# EAGLE schematic module_alu (EAGLE 6.5.0)

## Sheet 1 of 12
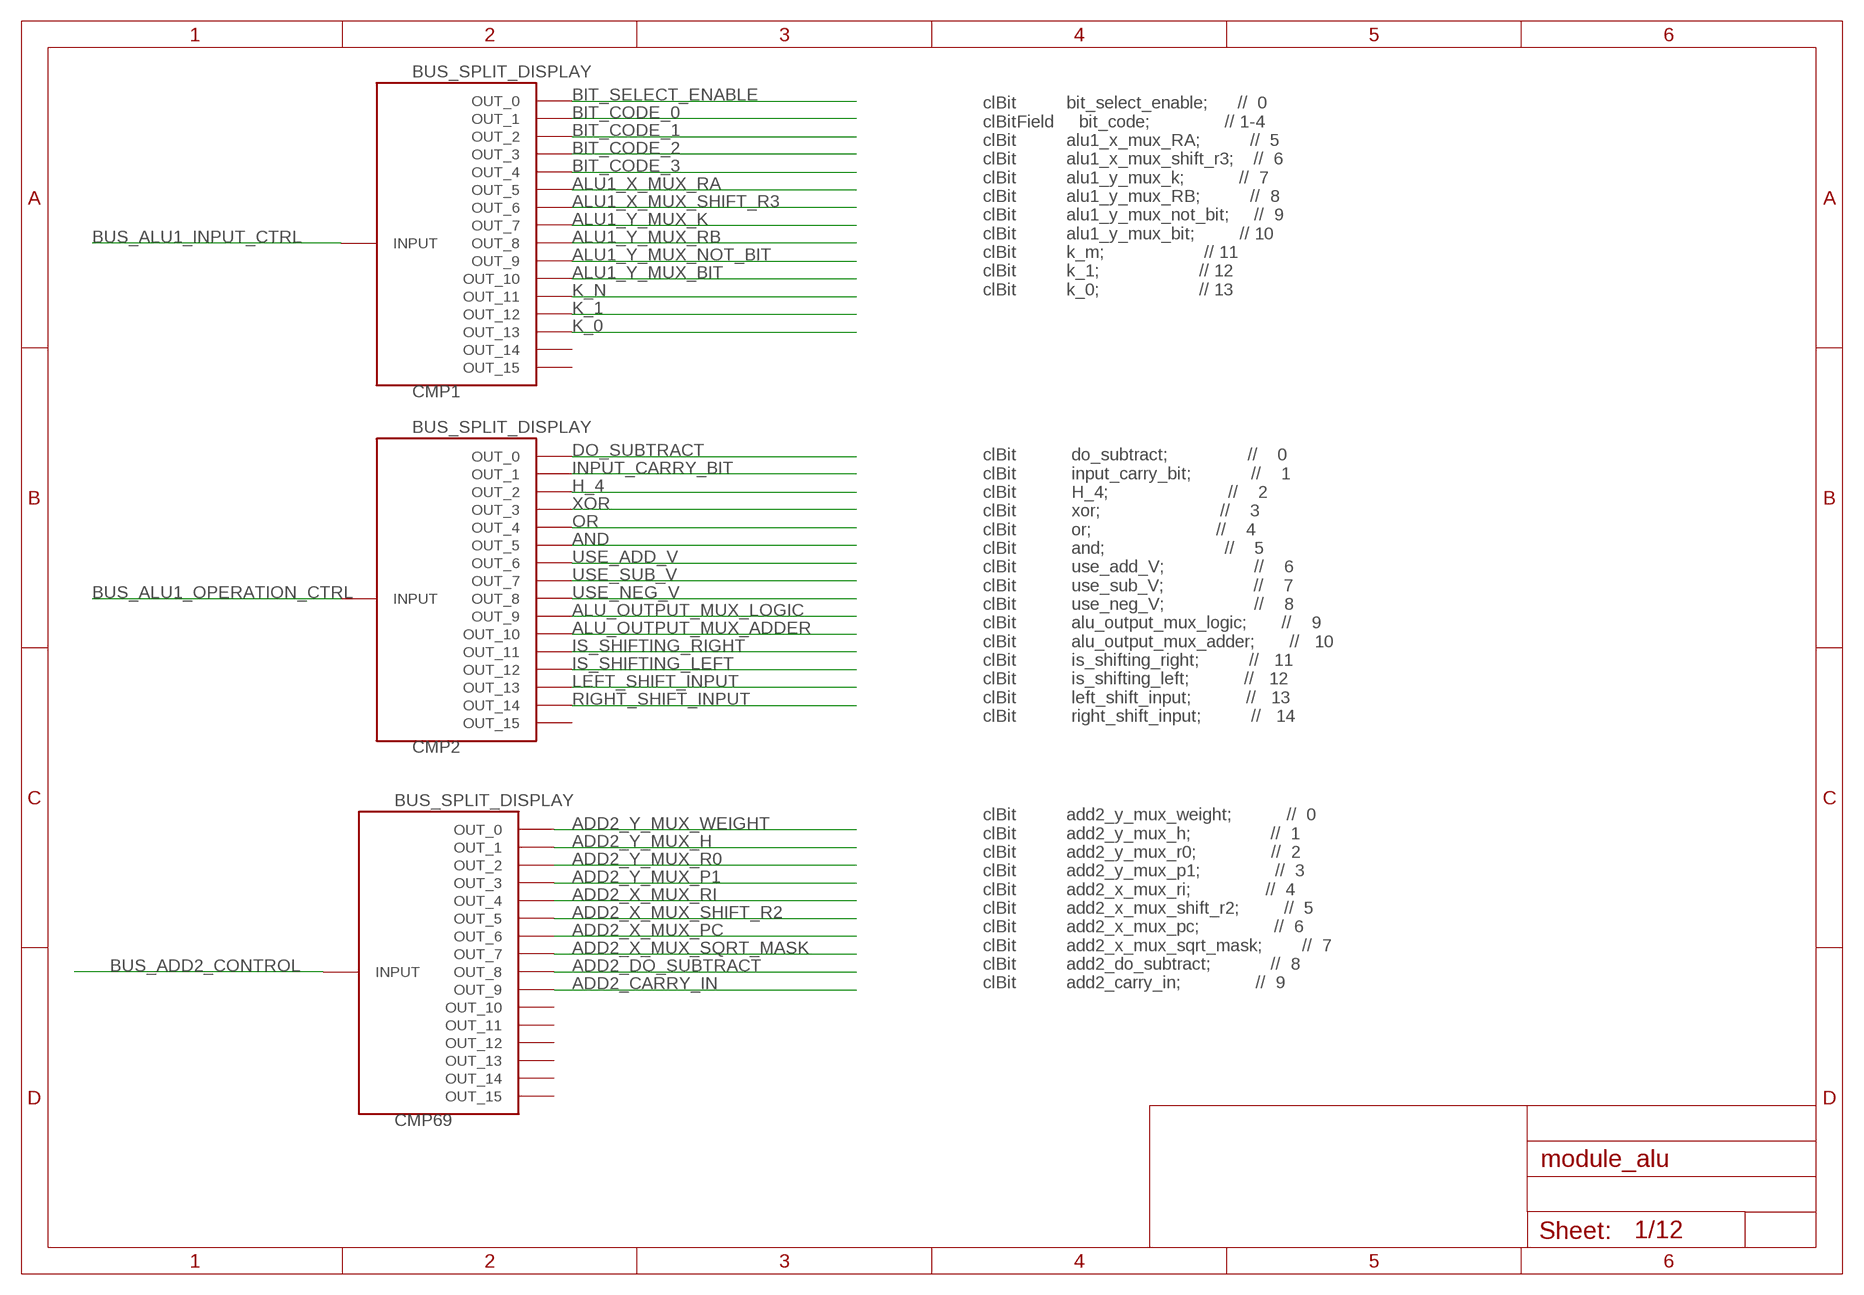
[diagram p0: schematic, sheet 1]

### Parts
CMP1  BUS_SPLIT_DISPLAY  [BUS_SPLIT_DISPLAY]
CMP2  BUS_SPLIT_DISPLAY  [BUS_SPLIT_DISPLAY]
CMP69  BUS_SPLIT_DISPLAY  [BUS_SPLIT_DISPLAY]

### Nets
ADD2_CARRY_IN: CMP69.P$10(OUT_9) ; also sheet 12
ADD2_DO_SUBTRACT: CMP69.P$9(OUT_8) ; also sheet 12
ADD2_X_MUX_PC: CMP69.P$7(OUT_6) ; also sheet 11
ADD2_X_MUX_RI: CMP69.P$5(OUT_4) ; also sheet 11
ADD2_X_MUX_SHIFT_R2: CMP69.P$6(OUT_5) ; also sheet 11
ADD2_X_MUX_SQRT_MASK: CMP69.P$8(OUT_7) ; also sheet 11
ADD2_Y_MUX_H: CMP69.P$2(OUT_1) ; also sheet 11
ADD2_Y_MUX_P1: CMP69.P$4(OUT_3) ; also sheet 11
ADD2_Y_MUX_R0: CMP69.P$3(OUT_2) ; also sheet 11
ADD2_Y_MUX_WEIGHT: CMP69.P$1(OUT_0) ; also sheet 11
ALU1_X_MUX_RA: CMP1.P$6(OUT_5) ; also sheet 4
ALU1_X_MUX_SHIFT_R3: CMP1.P$7(OUT_6) ; also sheet 4
ALU1_Y_MUX_BIT: CMP1.P$11(OUT_10) ; also sheet 4
ALU1_Y_MUX_K: CMP1.P$8(OUT_7) ; also sheet 4
ALU1_Y_MUX_NOT_BIT: CMP1.P$10(OUT_9) ; also sheet 4
ALU1_Y_MUX_RB: CMP1.P$9(OUT_8) ; also sheet 4
ALU_OUTPUT_MUX_ADDER: CMP2.P$11(OUT_10) ; also sheet 4
ALU_OUTPUT_MUX_LOGIC: CMP2.P$10(OUT_9) ; also sheet 4
AND: CMP2.P$6(OUT_5) ; also sheet 6
BIT_CODE_0: CMP1.P$2(OUT_1) ; also sheet 7
BIT_CODE_1: CMP1.P$3(OUT_2) ; also sheet 7
BIT_CODE_2: CMP1.P$4(OUT_3) ; also sheet 7
BIT_CODE_3: CMP1.P$5(OUT_4) ; also sheet 7
BIT_SELECT_ENABLE: CMP1.P$1(OUT_0) ; also sheet 7
BUS_ADD2_CONTROL: CMP69.INPUT
BUS_ALU1_INPUT_CTRL: CMP1.INPUT
BUS_ALU1_OPERATION_CTRL: CMP2.INPUT
DO_SUBTRACT: CMP2.P$1(OUT_0) ; also sheet 5
H_4: CMP2.P$3(OUT_2) ; also sheet 5
INPUT_CARRY_BIT: CMP2.P$2(OUT_1) ; also sheet 5
IS_SHIFTING_LEFT: CMP2.P$13(OUT_12) ; also sheet 4
IS_SHIFTING_RIGHT: CMP2.P$12(OUT_11) ; also sheet 4
K_0: CMP1.P$14(OUT_13) ; also sheet 3
K_1: CMP1.P$13(OUT_12) ; also sheet 3
K_N: CMP1.P$12(OUT_11) ; also sheet 3
LEFT_SHIFT_INPUT: CMP2.P$14(OUT_13) ; also sheet 4
OR: CMP2.P$5(OUT_4) ; also sheet 6
RIGHT_SHIFT_INPUT: CMP2.P$15(OUT_14) ; also sheet 4
USE_ADD_V: CMP2.P$7(OUT_6) ; also sheet 8
USE_NEG_V: CMP2.P$9(OUT_8) ; also sheet 8
USE_SUB_V: CMP2.P$8(OUT_7) ; also sheet 8
XOR: CMP2.P$4(OUT_3) ; also sheet 6
Unconnected: CMP1.P$15(OUT_14) CMP1.P$16(OUT_15) CMP2.P$16(OUT_15) CMP69.P$11(OUT_10) CMP69.P$12(OUT_11) CMP69.P$13(OUT_12) CMP69.P$14(OUT_13) CMP69.P$15(OUT_14) CMP69.P$16(OUT_15)

### Notes on the sheet
- clBit          bit_select_enable;      //  0
      clBitField     bit_code;               // 1-4
      clBit          alu1_x_mux_RA;          //  5
      clBit          alu1_x_mux_shift_r3;    //  6
      clBit          alu1_y_mux_k;           //  7
      clBit          alu1_y_mux_RB;          //  8
      clBit          alu1_y_mux_not_bit;     //  9
      clBit          alu1_y_mux_bit;         // 10
      clBit          k_m;                    // 11
      clBit          k_1;                    // 12
      clBit          k_0;                    // 13
- clBit           do_subtract;                //    0  
      clBit           input_carry_bit;            //    1
      clBit           H_4;                        //    2
      clBit           xor;                        //    3
      clBit           or;                         //    4
      clBit           and;                        //    5
      clBit           use_add_V;                  //    6
      clBit           use_sub_V;                  //    7
      clBit           use_neg_V;                  //    8
      clBit           alu_output_mux_logic;       //    9
      clBit           alu_output_mux_adder;       //   10
      clBit           is_shifting_right;          //   11
      clBit           is_shifting_left;           //   12
      clBit           left_shift_input;           //   13
      clBit           right_shift_input;          //   14
- clBit          add2_y_mux_weight;           //  0
      clBit          add2_y_mux_h;                //  1
      clBit          add2_y_mux_r0;               //  2
      clBit          add2_y_mux_p1;               //  3
      clBit          add2_x_mux_ri;               //  4
      clBit          add2_x_mux_shift_r2;         //  5
      clBit          add2_x_mux_pc;               //  6
      clBit          add2_x_mux_sqrt_mask;        //  7
      clBit          add2_do_subtract;            //  8
      clBit          add2_carry_in;               //  9

## Sheet 2 of 12
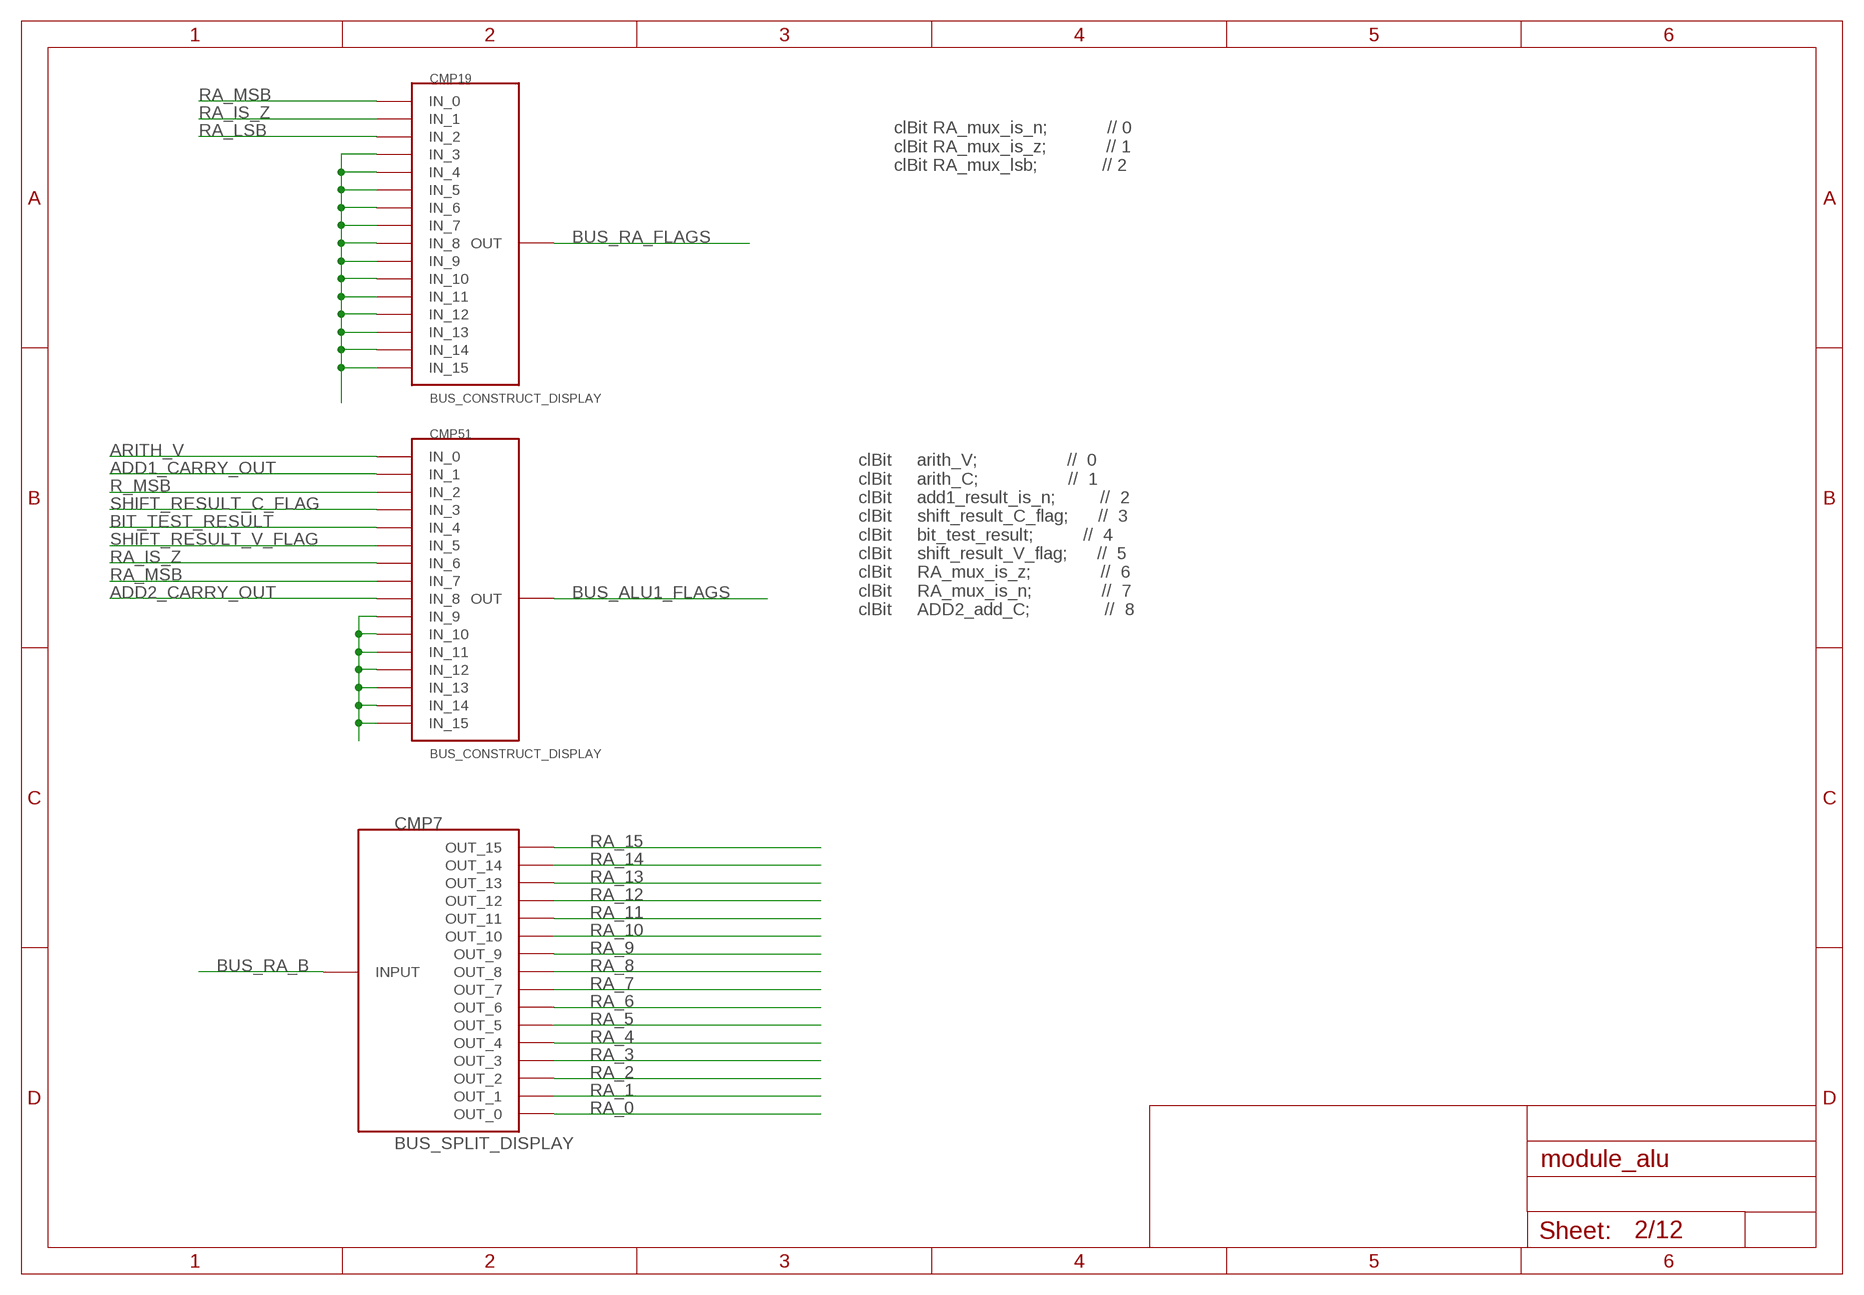
[diagram p1: schematic, sheet 2]

### Parts
CMP7  BUS_SPLIT_DISPLAY  [BUS_SPLIT_DISPLAY]
CMP19  BUS_CONSTRUCT_DISPLAY  [BUS_SPLIT_DISPLAY]
CMP51  BUS_CONSTRUCT_DISPLAY  [BUS_SPLIT_DISPLAY]

### Nets
ADD1_CARRY_OUT: CMP51.P$2(IN_1) ; also sheet 5
ADD2_CARRY_OUT: CMP51.P$9(IN_8) ; also sheet 12
ARITH_V: CMP51.P$1(IN_0) ; also sheet 8
BIT_TEST_RESULT: CMP51.P$5(IN_4) ; also sheet 9
BUS_ALU1_FLAGS: CMP51.INPUT(OUT)
BUS_RA_B: CMP7.INPUT ; also sheet 4
BUS_RA_FLAGS: CMP19.INPUT(OUT)
N$5: CMP19.P$4(IN_3) CMP19.P$5(IN_4) CMP19.P$6(IN_5) CMP19.P$7(IN_6) CMP19.P$8(IN_7) CMP19.P$9(IN_8) CMP19.P$10(IN_9) CMP19.P$11(IN_10) CMP19.P$12(IN_11) CMP19.P$13(IN_12) CMP19.P$14(IN_13) CMP19.P$15(IN_14) CMP19.P$16(IN_15)
N$6: CMP51.P$10(IN_9) CMP51.P$11(IN_10) CMP51.P$12(IN_11) CMP51.P$13(IN_12) CMP51.P$14(IN_13) CMP51.P$15(IN_14) CMP51.P$16(IN_15)
R_MSB: CMP51.P$3(IN_2) ; also sheet 5,8
RA_0: CMP7.P$1(OUT_0) ; also sheet 9
RA_1: CMP7.P$2(OUT_1) ; also sheet 9
RA_2: CMP7.P$3(OUT_2) ; also sheet 9
RA_3: CMP7.P$4(OUT_3) ; also sheet 9
RA_4: CMP7.P$5(OUT_4) ; also sheet 9
RA_5: CMP7.P$6(OUT_5) ; also sheet 9
RA_6: CMP7.P$7(OUT_6) ; also sheet 9
RA_7: CMP7.P$8(OUT_7) ; also sheet 9
RA_8: CMP7.P$9(OUT_8) ; also sheet 9
RA_9: CMP7.P$10(OUT_9) ; also sheet 9
RA_10: CMP7.P$11(OUT_10) ; also sheet 9
RA_11: CMP7.P$12(OUT_11) ; also sheet 9
RA_12: CMP7.P$13(OUT_12) ; also sheet 9
RA_13: CMP7.P$14(OUT_13) ; also sheet 9
RA_14: CMP7.P$15(OUT_14) ; also sheet 9,10
RA_15: CMP7.P$16(OUT_15) ; also sheet 9
RA_IS_Z: CMP19.P$2(IN_1) CMP51.P$7(IN_6) ; also sheet 4
RA_LSB: CMP19.P$3(IN_2) ; also sheet 4,10
RA_MSB: CMP19.P$1(IN_0) CMP51.P$8(IN_7) ; also sheet 4,10
SHIFT_RESULT_C_FLAG: CMP51.P$4(IN_3) ; also sheet 10
SHIFT_RESULT_V_FLAG: CMP51.P$6(IN_5) ; also sheet 10

### Notes on the sheet
- clBit RA_mux_is_n;            // 0 
      clBit RA_mux_is_z;            // 1
      clBit RA_mux_lsb;             // 2
- clBit     arith_V;                  //  0
      clBit     arith_C;                  //  1
      clBit     add1_result_is_n;         //  2
      clBit     shift_result_C_flag;      //  3
      clBit     bit_test_result;          //  4
      clBit     shift_result_V_flag;      //  5
      clBit     RA_mux_is_z;              //  6
      clBit     RA_mux_is_n;              //  7
      clBit     ADD2_add_C;               //  8

## Sheet 3 of 12
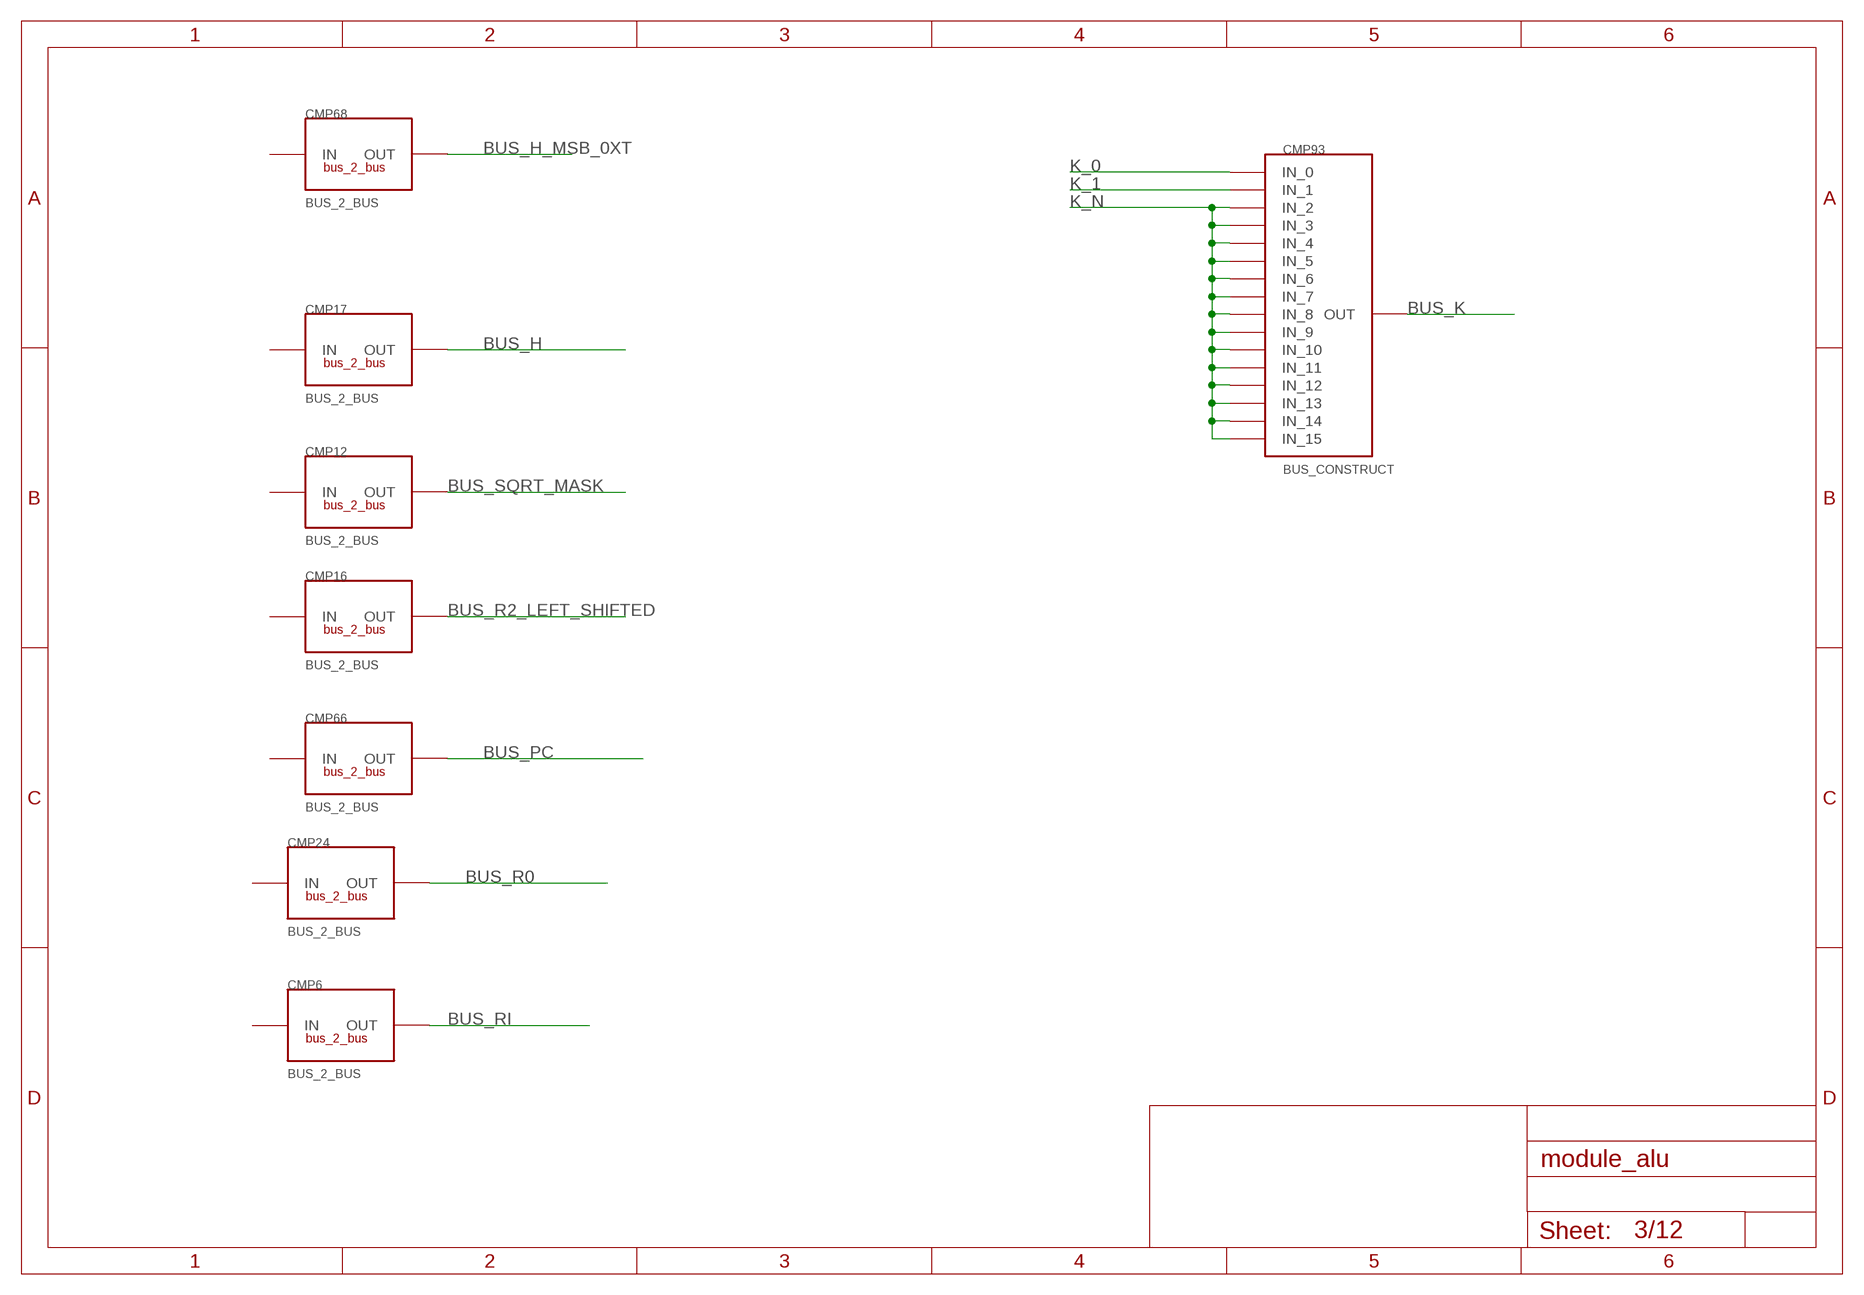
[diagram p2: schematic, sheet 3]

### Parts
CMP6  BUS_2_BUS  [BUS2BUS]
CMP12  BUS_2_BUS  [BUS2BUS]
CMP16  BUS_2_BUS  [BUS2BUS]
CMP17  BUS_2_BUS  [BUS2BUS]
CMP24  BUS_2_BUS  [BUS2BUS]
CMP66  BUS_2_BUS  [BUS2BUS]
CMP68  BUS_2_BUS  [BUS2BUS]
CMP93  BUS_CONSTRUCT  [BUS_SPLIT]

### Nets
BUS_H: CMP17.P$2(OUT) ; also sheet 11
BUS_H_MSB_0XT: CMP68.P$2(OUT) ; also sheet 11
BUS_K: CMP93.INPUT(OUT) ; also sheet 4
BUS_PC: CMP66.P$2(OUT) ; also sheet 11
BUS_R0: CMP24.P$2(OUT) ; also sheet 11
BUS_R2_LEFT_SHIFTED: CMP16.P$2(OUT) ; also sheet 11
BUS_RI: CMP6.P$2(OUT) ; also sheet 11
BUS_SQRT_MASK: CMP12.P$2(OUT) ; also sheet 11
K_0: CMP93.P$1(IN_0) ; also sheet 1
K_1: CMP93.P$2(IN_1) ; also sheet 1
K_N: CMP93.P$3(IN_2) CMP93.P$4(IN_3) CMP93.P$5(IN_4) CMP93.P$6(IN_5) CMP93.P$7(IN_6) CMP93.P$8(IN_7) CMP93.P$9(IN_8) CMP93.P$10(IN_9) CMP93.P$11(IN_10) CMP93.P$12(IN_11) CMP93.P$13(IN_12) CMP93.P$14(IN_13) CMP93.P$15(IN_14) CMP93.P$16(IN_15) ; also sheet 1
Unconnected: CMP6.P$1(IN) CMP12.P$1(IN) CMP16.P$1(IN) CMP17.P$1(IN) CMP24.P$1(IN) CMP66.P$1(IN) CMP68.P$1(IN)

## Sheet 4 of 12
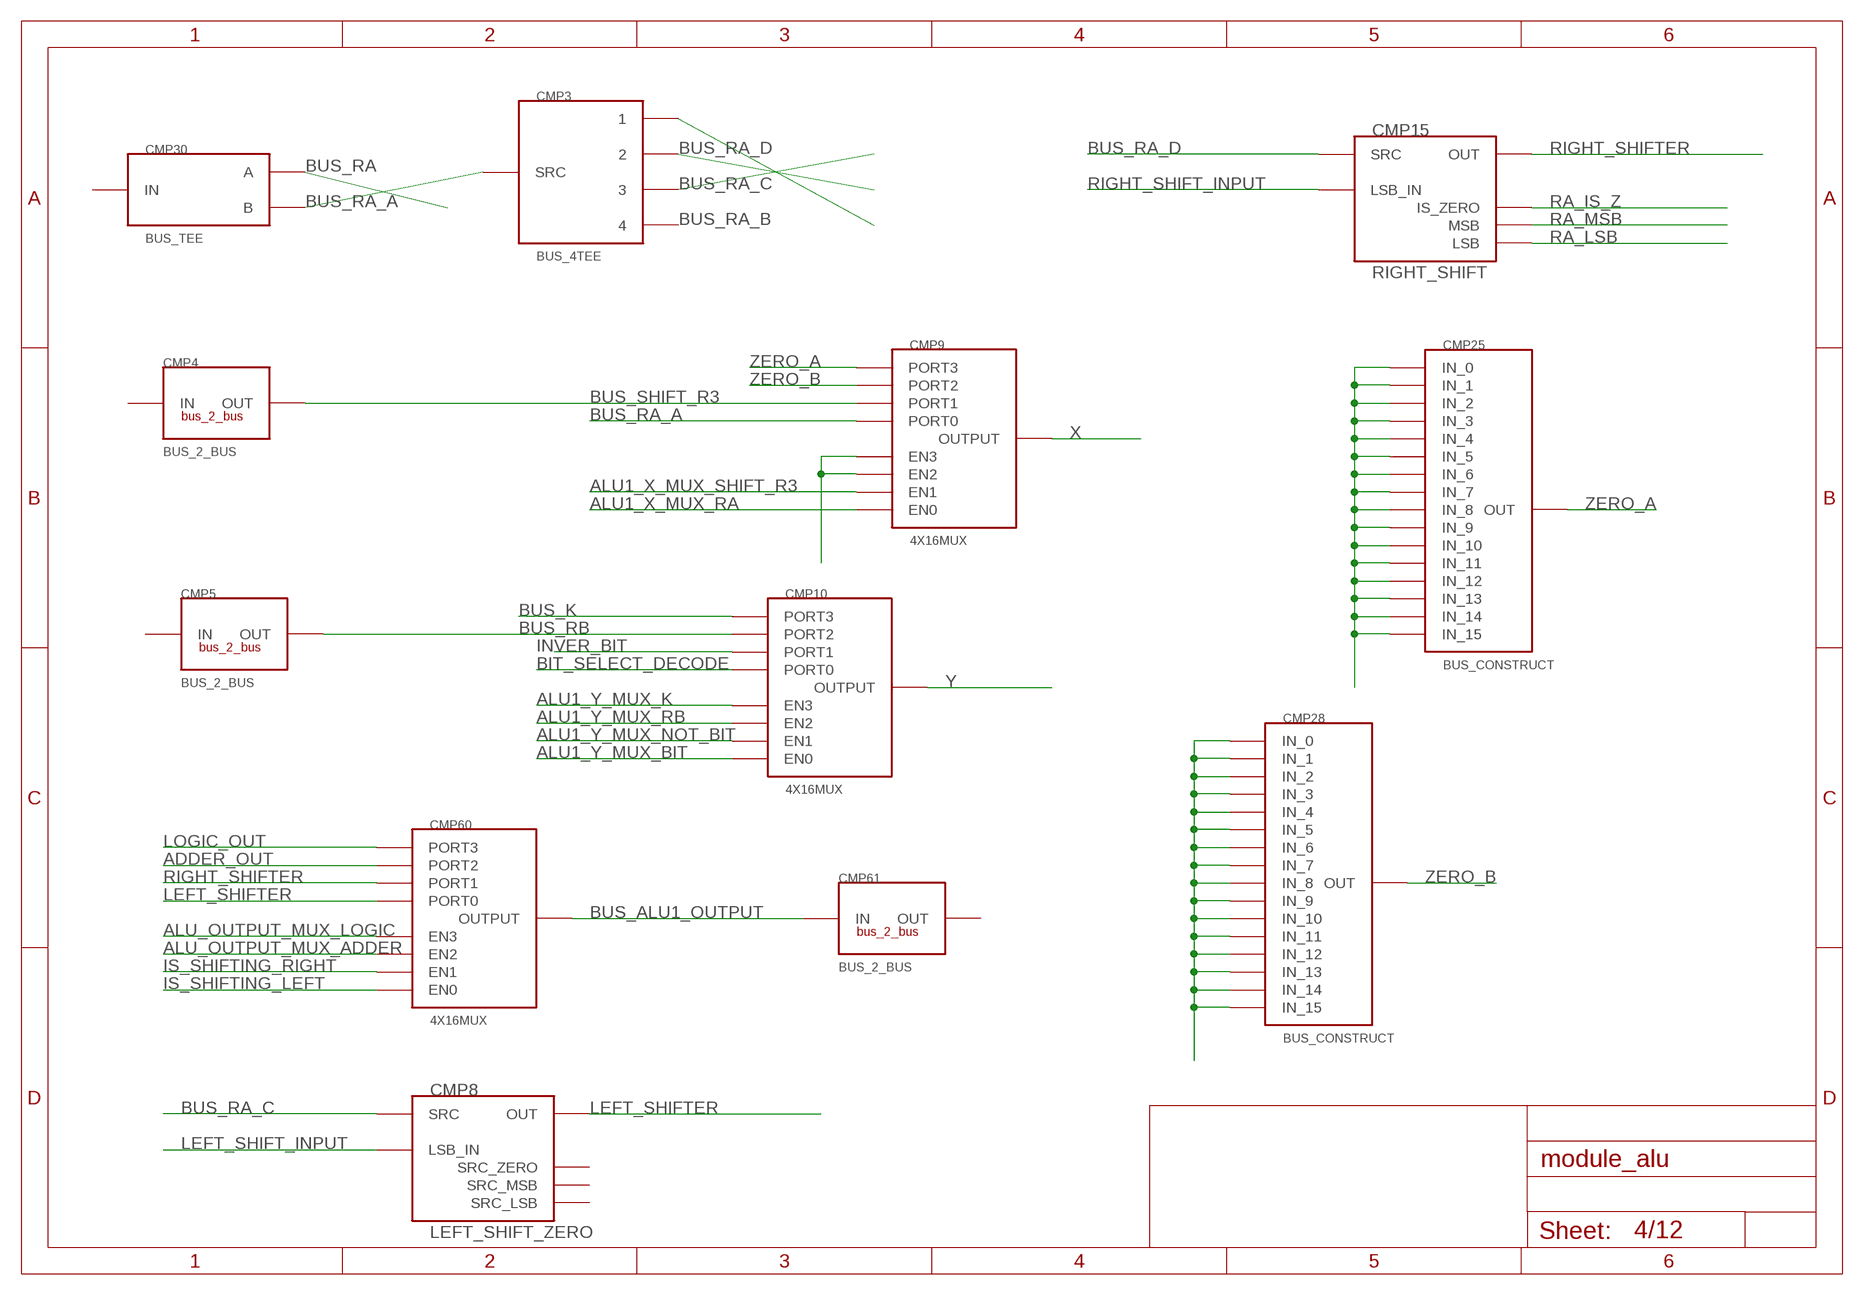
[diagram p3: schematic, sheet 4]

### Parts
CMP3  BUS_4TEE  [BUS_4TEE]
CMP4  BUS_2_BUS  [BUS2BUS]
CMP5  BUS_2_BUS  [BUS2BUS]
CMP8  LEFT_SHIFT_ZERO  [SHIFT_ZERO]
CMP9  4X16MUX  [4X16MUX]
CMP10  4X16MUX  [4X16MUX]
CMP15  RIGHT_SHIFT  [SHIFT_ZERO]
CMP25  BUS_CONSTRUCT  [BUS_SPLIT]
CMP28  BUS_CONSTRUCT  [BUS_SPLIT]
CMP30  BUS_TEE  [BUS_TEE]
CMP60  4X16MUX  [4X16MUX]
CMP61  BUS_2_BUS  [BUS2BUS]

### Nets
ADDER_OUT: CMP60.PORT2 ; also sheet 5
ALU1_X_MUX_RA: CMP9.EN0 ; also sheet 1
ALU1_X_MUX_SHIFT_R3: CMP9.EN1 ; also sheet 1
ALU1_Y_MUX_BIT: CMP10.EN0 ; also sheet 1
ALU1_Y_MUX_K: CMP10.EN3 ; also sheet 1
ALU1_Y_MUX_NOT_BIT: CMP10.EN1 ; also sheet 1
ALU1_Y_MUX_RB: CMP10.EN2 ; also sheet 1
ALU_OUTPUT_MUX_ADDER: CMP60.EN2 ; also sheet 1
ALU_OUTPUT_MUX_LOGIC: CMP60.EN3 ; also sheet 1
BIT_SELECT_DECODE: CMP10.PORT0 ; also sheet 7
BUS_ALU1_OUTPUT: CMP60.PORTOUT(OUTPUT) CMP61.P$1(IN)
BUS_K: CMP10.PORT3 ; also sheet 3
BUS_RA: CMP3.SRC CMP30.OUTB(B)
BUS_RA_A: CMP9.PORT0 CMP30.OUT_A(A)
BUS_RA_B: CMP3.1 ; also sheet 2
BUS_RA_C: CMP3.2 CMP8.LSRC(SRC)
BUS_RA_D: CMP3.3 CMP15.RSRC(SRC)
BUS_RB: CMP5.P$2(OUT) CMP10.PORT2
BUS_SHIFT_R3: CMP4.P$2(OUT) CMP9.PORT1
INVER_BIT: CMP10.PORT1 ; also sheet 7
IS_SHIFTING_LEFT: CMP60.EN0 ; also sheet 1
IS_SHIFTING_RIGHT: CMP60.EN1 ; also sheet 1
LEFT_SHIFT_INPUT: CMP8.SHIFT_IN(LSB_IN) ; also sheet 1
LEFT_SHIFTER: CMP8.RSRC(OUT) CMP60.PORT0
LOGIC_OUT: CMP60.PORT3 ; also sheet 6
N$1: CMP9.EN2 CMP9.EN3
N$4: CMP25.P$1(IN_0) CMP25.P$2(IN_1) CMP25.P$3(IN_2) CMP25.P$4(IN_3) CMP25.P$5(IN_4) CMP25.P$6(IN_5) CMP25.P$7(IN_6) CMP25.P$8(IN_7) CMP25.P$9(IN_8) CMP25.P$10(IN_9) CMP25.P$11(IN_10) CMP25.P$12(IN_11) CMP25.P$13(IN_12) CMP25.P$14(IN_13) CMP25.P$15(IN_14) CMP25.P$16(IN_15)
N$7: CMP28.P$1(IN_0) CMP28.P$2(IN_1) CMP28.P$3(IN_2) CMP28.P$4(IN_3) CMP28.P$5(IN_4) CMP28.P$6(IN_5) CMP28.P$7(IN_6) CMP28.P$8(IN_7) CMP28.P$9(IN_8) CMP28.P$10(IN_9) CMP28.P$11(IN_10) CMP28.P$12(IN_11) CMP28.P$13(IN_12) CMP28.P$14(IN_13) CMP28.P$15(IN_14) CMP28.P$16(IN_15)
RA_IS_Z: CMP15.IS_ZERO ; also sheet 2
RA_LSB: CMP15.LSB ; also sheet 2,10
RA_MSB: CMP15.MSB ; also sheet 2,10
RIGHT_SHIFT_INPUT: CMP15.SHIFT_IN(LSB_IN) ; also sheet 1
RIGHT_SHIFTER: CMP15.LSRC(OUT) CMP60.PORT1
X: CMP9.PORTOUT(OUTPUT) ; also sheet 5
Y: CMP10.PORTOUT(OUTPUT) ; also sheet 5
ZERO_A: CMP9.PORT3 CMP25.INPUT(OUT)
ZERO_B: CMP9.PORT2 CMP28.INPUT(OUT)
Unconnected: CMP3.4 CMP4.P$1(IN) CMP5.P$1(IN) CMP8.IS_ZERO(SRC_ZERO) CMP8.LSB(SRC_LSB) CMP8.MSB(SRC_MSB) CMP30.INPUT(IN) CMP61.P$2(OUT)

## Sheet 5 of 12
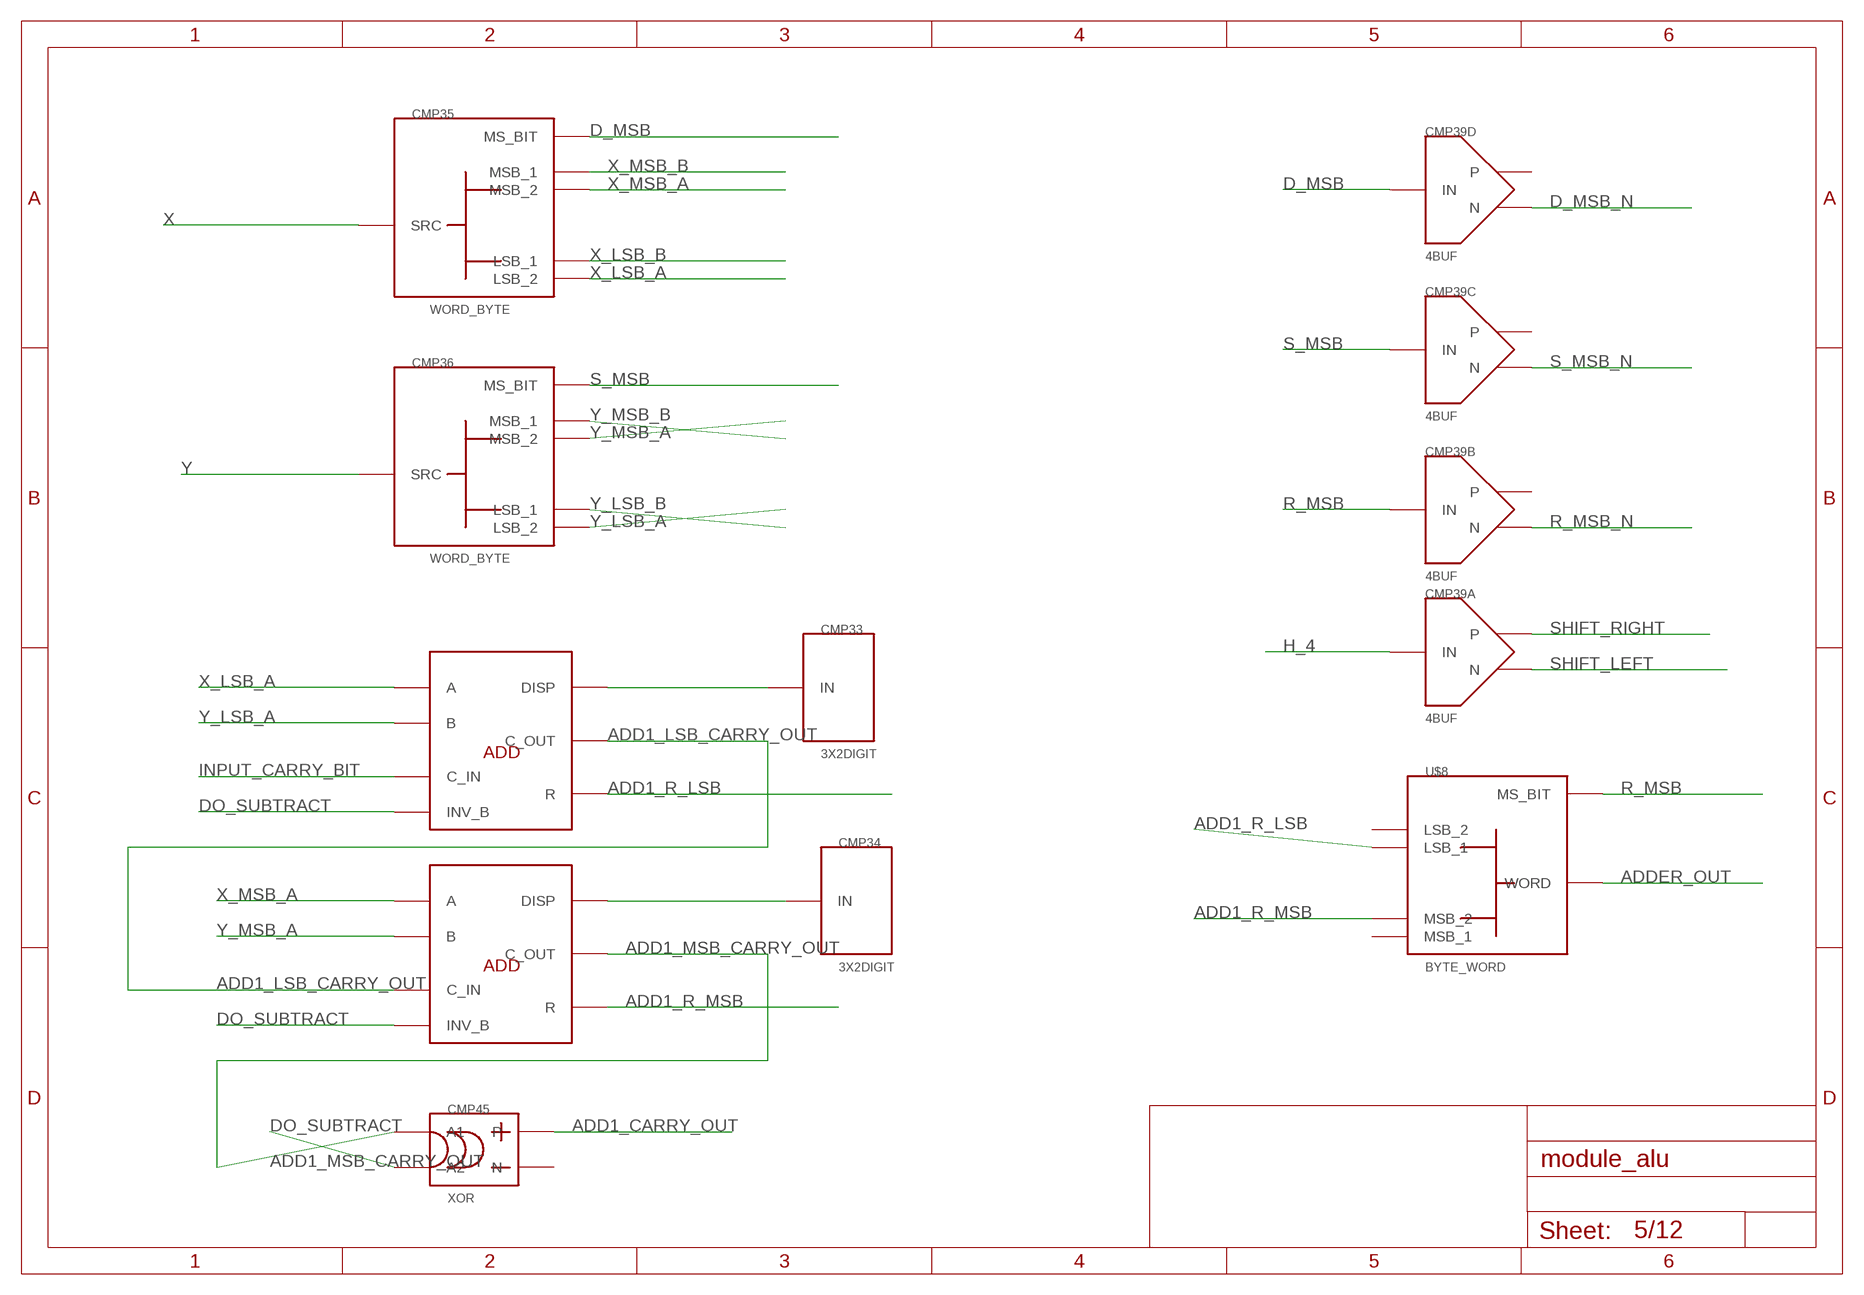
[diagram p4: schematic, sheet 5]

### Parts
CMP31  8BIT_ADD_SUB  [8BIT_ADD_SUB]
CMP32  8BIT_ADD_SUB  [8BIT_ADD_SUB]
CMP33  3X2DIGIT  [3X2DIGIT]
CMP34  3X2DIGIT  [3X2DIGIT]
CMP35  WORD_BYTE  [WORD_BYTE]
CMP36  WORD_BYTE  [WORD_BYTE]
CMP39  4BUF  [4BUF]
CMP45  XOR  [XOR]
U$8  BYTE_WORD  [WORD_BYTE]

### Nets
ADD1_CARRY_OUT: CMP45.OUT_P(P) ; also sheet 2
ADD1_LSB_CARRY_OUT: CMP31.C_OUT CMP32.C_IN
ADD1_MSB_CARRY_OUT: CMP32.C_OUT CMP45.P$1(A1)
ADD1_R_LSB: CMP31.R U$8.LSB_1
ADD1_R_MSB: CMP32.R U$8.MSB_2
ADDER_OUT: U$8.SRC(WORD) ; also sheet 4
D_MSB: CMP35.MS_BIT CMP39.A4(D:IN) ; also sheet 8
D_MSB_N: CMP39.N4(D:N) ; also sheet 8
DO_SUBTRACT: CMP31.INV_B CMP32.INV_B CMP45.P$2(A2) ; also sheet 1
H_4: CMP39.A1(A:IN) ; also sheet 1
INPUT_CARRY_BIT: CMP31.C_IN ; also sheet 1
N$67: CMP31.DISP CMP33.P$1(IN)
N$68: CMP32.DISP CMP34.P$1(IN)
R_MSB: CMP39.A2(B:IN) U$8.MS_BIT ; also sheet 2,8
R_MSB_N: CMP39.N2(B:N) ; also sheet 8
S_MSB: CMP36.MS_BIT CMP39.A3(C:IN) ; also sheet 8
S_MSB_N: CMP39.N3(C:N) ; also sheet 8
SHIFT_LEFT: CMP39.N1(A:N) ; also sheet 10
SHIFT_RIGHT: CMP39.P1(A:P) ; also sheet 10
X: CMP35.SRC ; also sheet 4
X_LSB_A: CMP31.A CMP35.LSB_2
X_LSB_B: CMP35.LSB_1 ; also sheet 6
X_MSB_A: CMP32.A CMP35.MSB_2
X_MSB_B: CMP35.MSB_1 ; also sheet 6
Y: CMP36.SRC ; also sheet 4
Y_LSB_A: CMP31.B CMP36.LSB_1
Y_LSB_B: CMP36.LSB_2 ; also sheet 6
Y_MSB_A: CMP32.B CMP36.MSB_1
Y_MSB_B: CMP36.MSB_2 ; also sheet 6
Unconnected: CMP39.P2(B:P) CMP39.P3(C:P) CMP39.P4(D:P) CMP45.OUT_N(N) U$8.LSB_2 U$8.MSB_1

## Sheet 6 of 12
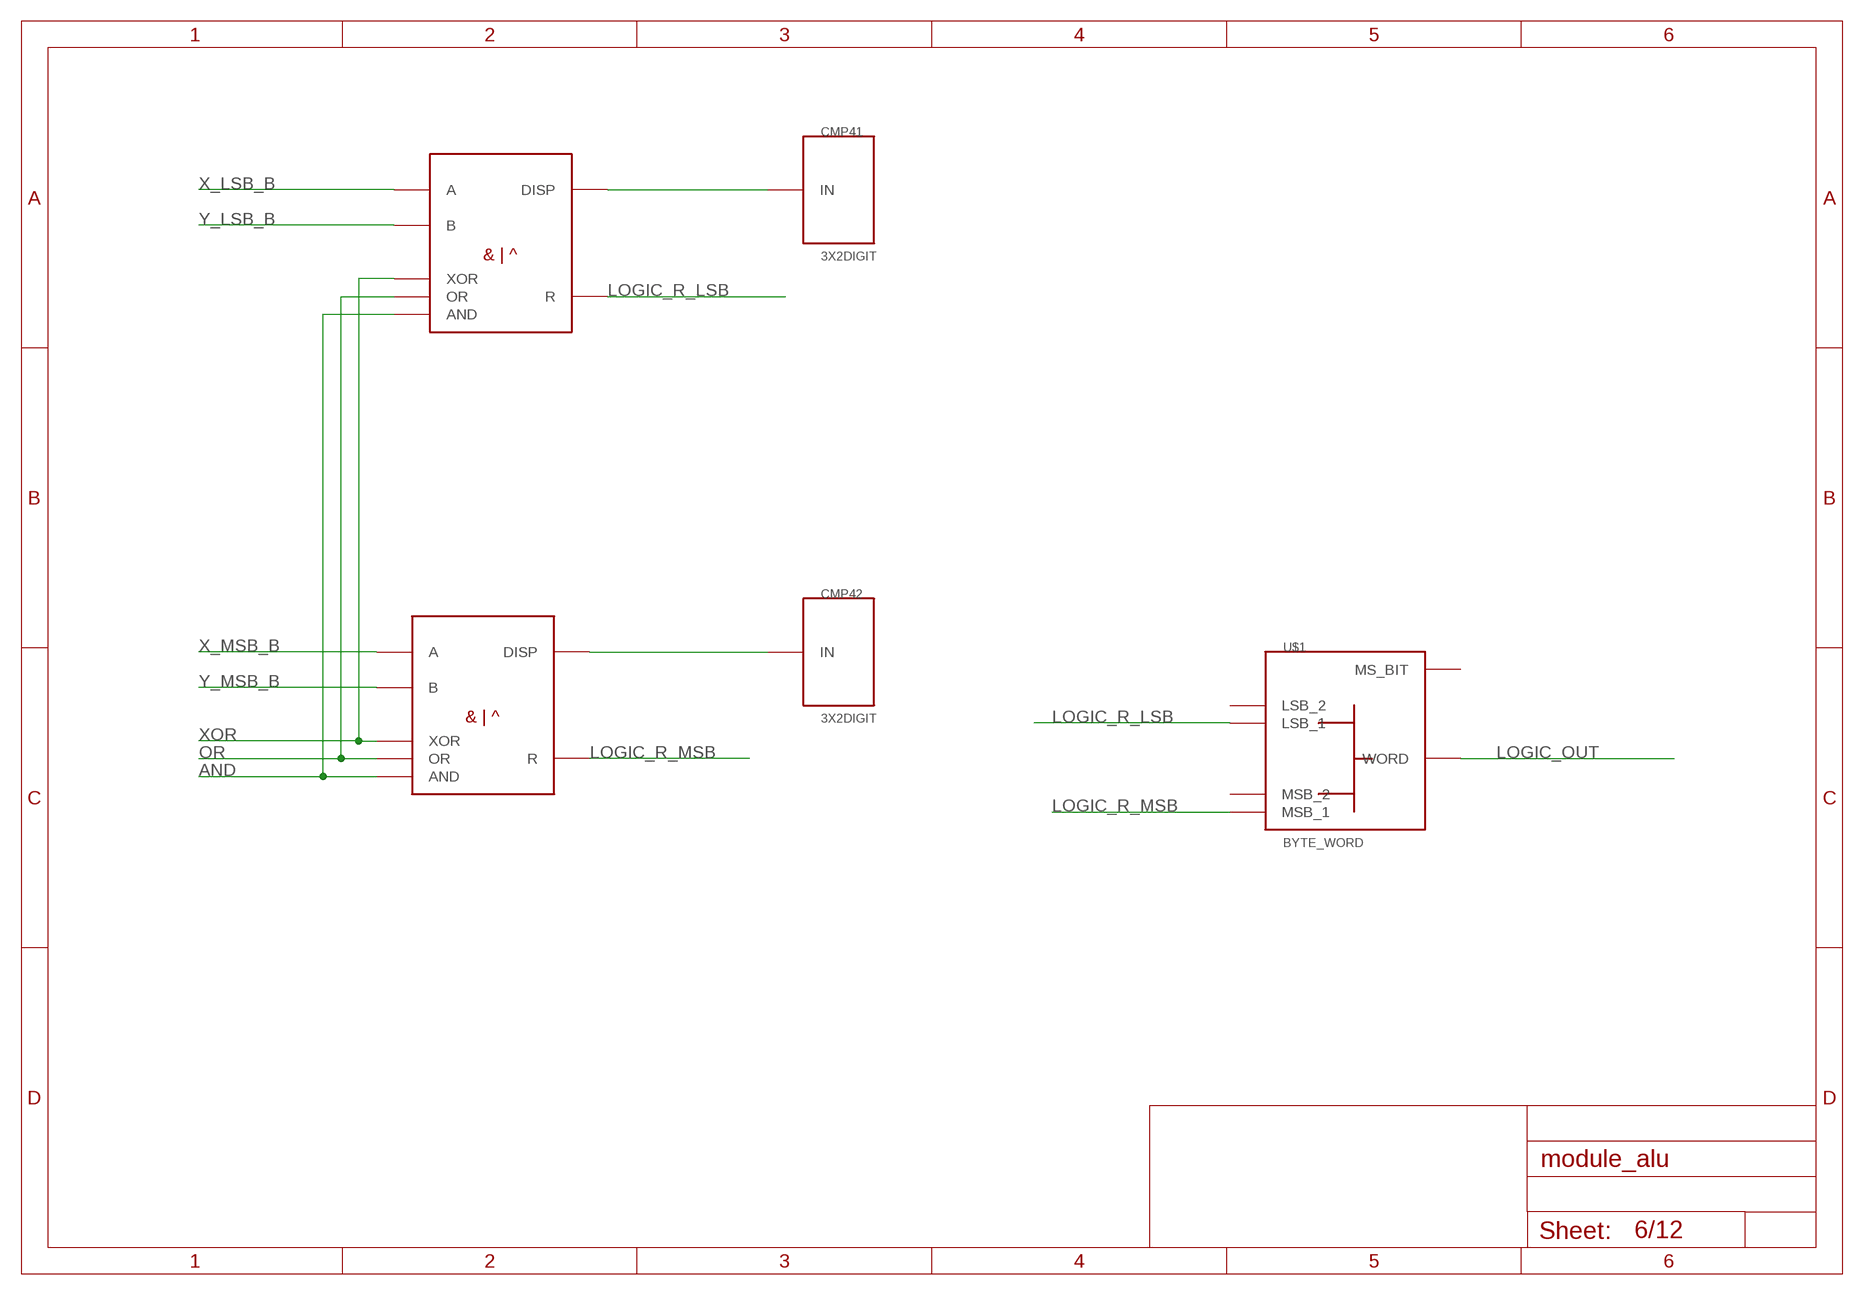
[diagram p5: schematic, sheet 6]

### Parts
CMP41  3X2DIGIT  [3X2DIGIT]
CMP42  3X2DIGIT  [3X2DIGIT]
CMP46  8BIT_LOGIC  [8BIT_LOGIC]
CMP47  8BIT_LOGIC  [8BIT_LOGIC]
U$1  BYTE_WORD  [WORD_BYTE]

### Nets
AND: CMP46.AND CMP47.AND ; also sheet 1
LOGIC_OUT: U$1.SRC(WORD) ; also sheet 4
LOGIC_R_LSB: CMP47.R U$1.LSB_1
LOGIC_R_MSB: CMP46.R U$1.MSB_1
N$89: CMP41.P$1(IN) CMP47.DISP
N$90: CMP42.P$1(IN) CMP46.DISP
OR: CMP46.OR CMP47.OR ; also sheet 1
X_LSB_B: CMP47.A ; also sheet 5
X_MSB_B: CMP46.A ; also sheet 5
XOR: CMP46.XOR CMP47.XOR ; also sheet 1
Y_LSB_B: CMP47.B ; also sheet 5
Y_MSB_B: CMP46.B ; also sheet 5
Unconnected: U$1.LSB_2 U$1.MS_BIT U$1.MSB_2

## Sheet 7 of 12
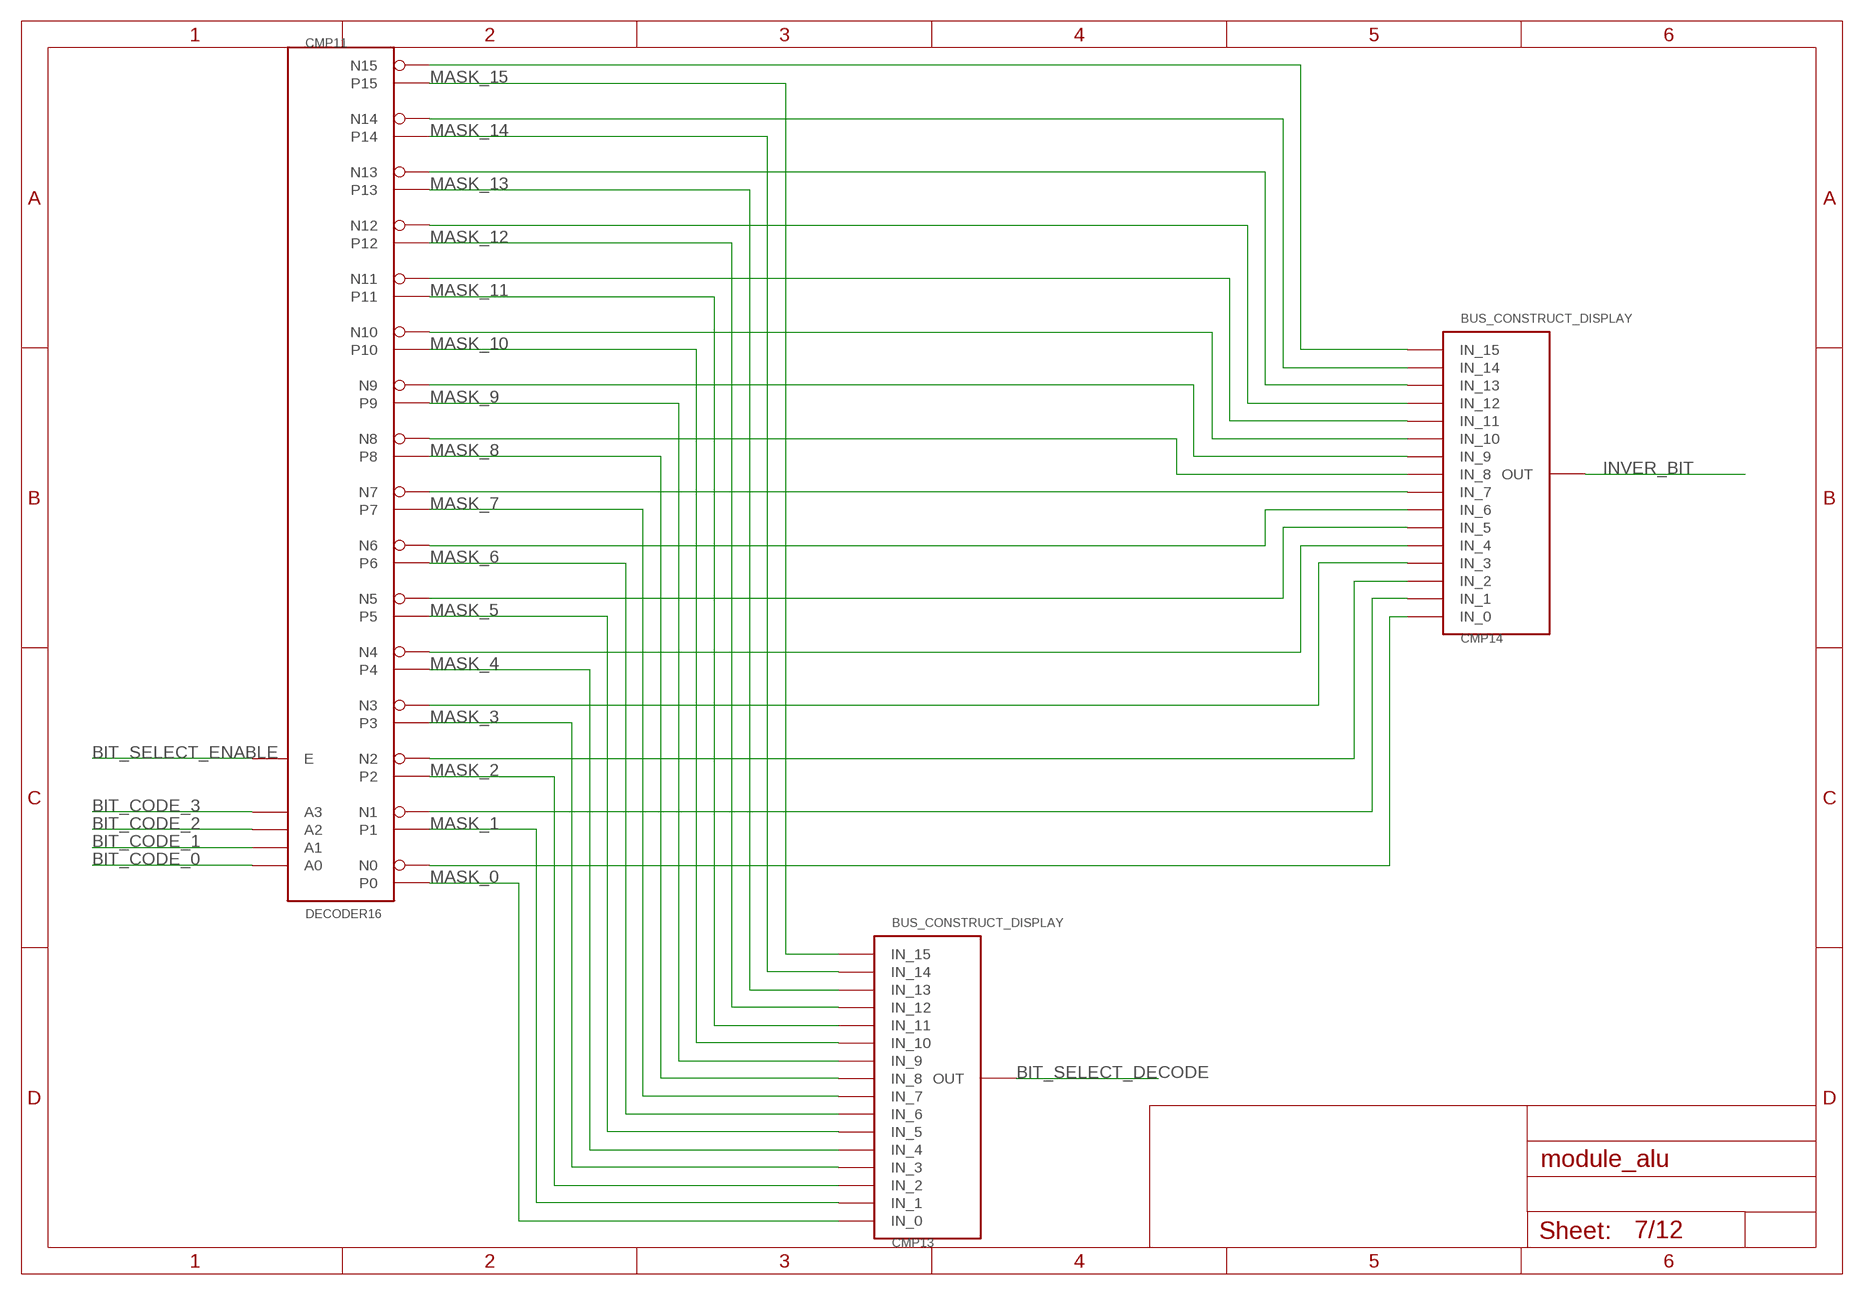
[diagram p6: schematic, sheet 7]

### Parts
CMP11  DECODER16  [DECODER16]
CMP13  BUS_CONSTRUCT_DISPLAY  [BUS_SPLIT_DISPLAY]
CMP14  BUS_CONSTRUCT_DISPLAY  [BUS_SPLIT_DISPLAY]

### Nets
BIT_CODE_0: CMP11.A0 ; also sheet 1
BIT_CODE_1: CMP11.A1 ; also sheet 1
BIT_CODE_2: CMP11.A2 ; also sheet 1
BIT_CODE_3: CMP11.A3 ; also sheet 1
BIT_SELECT_DECODE: CMP13.INPUT(OUT) ; also sheet 4
BIT_SELECT_ENABLE: CMP11.E ; also sheet 1
INVER_BIT: CMP14.INPUT(OUT) ; also sheet 4
MASK_0: CMP11.P0 CMP13.P$1(IN_0) ; also sheet 9
MASK_1: CMP11.P1 CMP13.P$2(IN_1) ; also sheet 9
MASK_2: CMP11.P2 CMP13.P$3(IN_2) ; also sheet 9
MASK_3: CMP11.P3 CMP13.P$4(IN_3) ; also sheet 9
MASK_4: CMP11.P4 CMP13.P$5(IN_4) ; also sheet 9
MASK_5: CMP11.P5 CMP13.P$6(IN_5) ; also sheet 9
MASK_6: CMP11.P6 CMP13.P$7(IN_6) ; also sheet 9
MASK_7: CMP11.P7 CMP13.P$8(IN_7) ; also sheet 9
MASK_8: CMP11.P8 CMP13.P$9(IN_8) ; also sheet 9
MASK_9: CMP11.P9 CMP13.P$10(IN_9) ; also sheet 9
MASK_10: CMP11.P10 CMP13.P$11(IN_10) ; also sheet 9
MASK_11: CMP11.P11 CMP13.P$12(IN_11) ; also sheet 9
MASK_12: CMP11.P12 CMP13.P$13(IN_12) ; also sheet 9
MASK_13: CMP11.P13 CMP13.P$14(IN_13) ; also sheet 9
MASK_14: CMP11.P14 CMP13.P$15(IN_14) ; also sheet 9
MASK_15: CMP11.P15 CMP13.P$16(IN_15) ; also sheet 9
N$20: CMP11.N0 CMP14.P$1(IN_0)
N$21: CMP11.N1 CMP14.P$2(IN_1)
N$22: CMP11.N2 CMP14.P$3(IN_2)
N$23: CMP11.N3 CMP14.P$4(IN_3)
N$24: CMP11.N4 CMP14.P$5(IN_4)
N$25: CMP11.N5 CMP14.P$6(IN_5)
N$26: CMP11.N6 CMP14.P$7(IN_6)
N$27: CMP11.N7 CMP14.P$8(IN_7)
N$28: CMP11.N8 CMP14.P$9(IN_8)
N$29: CMP11.N9 CMP14.P$10(IN_9)
N$30: CMP11.N10 CMP14.P$11(IN_10)
N$31: CMP11.N11 CMP14.P$12(IN_11)
N$32: CMP11.N12 CMP14.P$13(IN_12)
N$33: CMP11.N13 CMP14.P$14(IN_13)
N$34: CMP11.N14 CMP14.P$15(IN_14)
N$35: CMP11.N15 CMP14.P$16(IN_15)

## Sheet 8 of 12
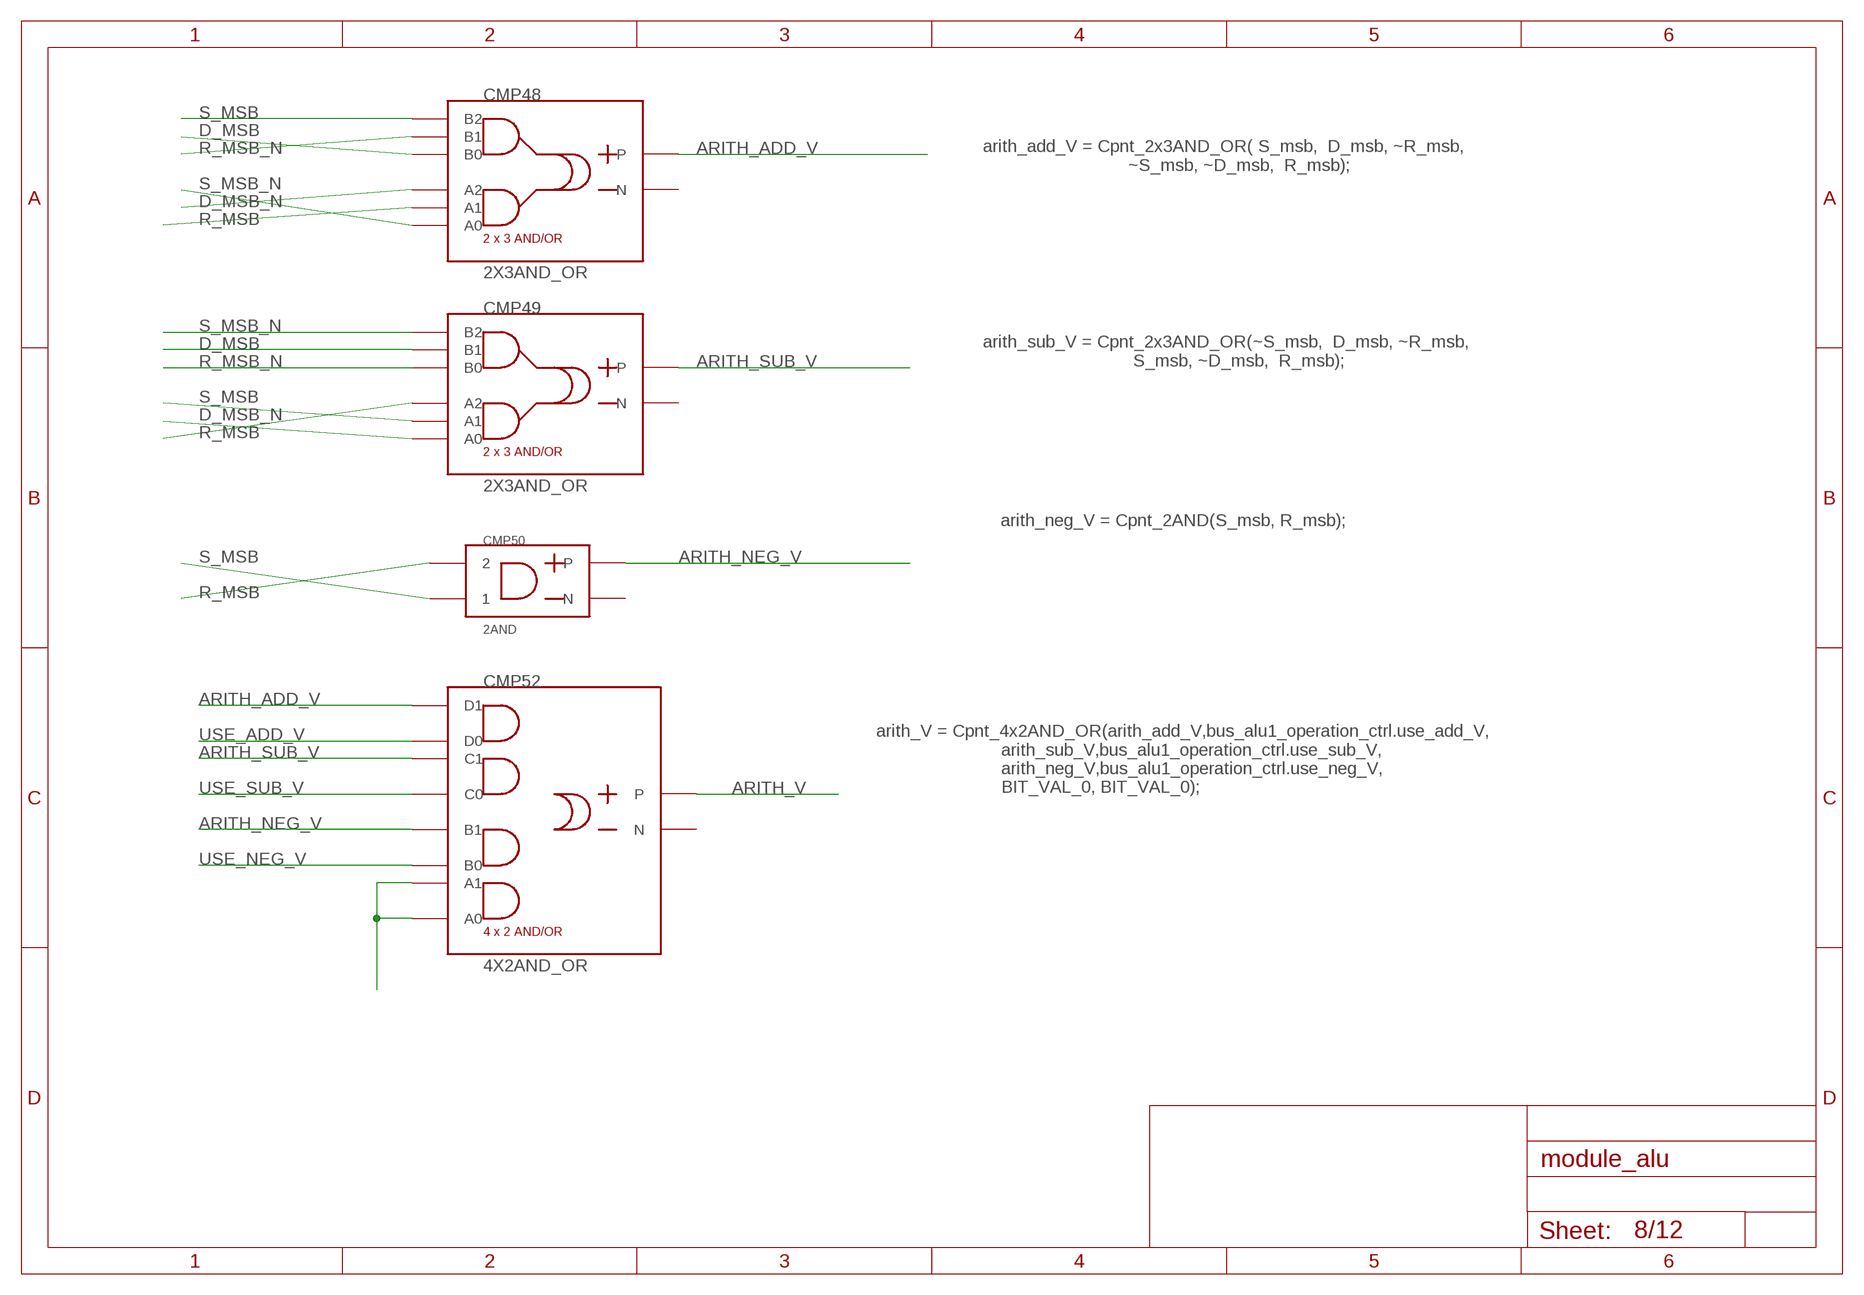
[diagram p7: schematic, sheet 8]

### Parts
CMP48  2X3AND_OR  [2X3AND_OR]
CMP49  2X3AND_OR  [2X3AND_OR]
CMP50  2AND  [2AND]
CMP52  4X2AND_OR  [4X2AND_OR]

### Nets
ARITH_ADD_V: CMP48.OUT_P(P) CMP52.P$8(D1)
ARITH_NEG_V: CMP50.OUT_P(P) CMP52.P$4(B1)
ARITH_SUB_V: CMP49.OUT_P(P) CMP52.P$6(C1)
ARITH_V: CMP52.OUT_P(P) ; also sheet 2
D_MSB: CMP48.P$4(B0) CMP49.P$5(B1) ; also sheet 5
D_MSB_N: CMP48.P$3(A2) CMP49.P$1(A0) ; also sheet 5
N$115: CMP52.P$1(A0) CMP52.P$2(A1)
R_MSB: CMP48.P$2(A1) CMP49.P$3(A2) CMP50.P$2 ; also sheet 2,5
R_MSB_N: CMP48.P$5(B1) CMP49.P$4(B0) ; also sheet 5
S_MSB: CMP48.P$6(B2) CMP49.P$2(A1) CMP50.P$1 ; also sheet 5
S_MSB_N: CMP48.P$1(A0) CMP49.P$6(B2) ; also sheet 5
USE_ADD_V: CMP52.P$7(D0) ; also sheet 1
USE_NEG_V: CMP52.P$3(B0) ; also sheet 1
USE_SUB_V: CMP52.P$5(C0) ; also sheet 1
Unconnected: CMP48.OUT_M(N) CMP49.OUT_M(N) CMP50.OUT_M(N) CMP52.OUT_M(N)

### Notes on the sheet
- arith_add_V = Cpnt_2x3AND_OR( S_msb,  D_msb, ~R_msb,
                                   ~S_msb, ~D_msb,  R_msb);
- arith_sub_V = Cpnt_2x3AND_OR(~S_msb,  D_msb, ~R_msb,
                                    S_msb, ~D_msb,  R_msb);
- arith_neg_V = Cpnt_2AND(S_msb, R_msb);
- arith_V = Cpnt_4x2AND_OR(arith_add_V,bus_alu1_operation_ctrl.use_add_V,
                               arith_sub_V,bus_alu1_operation_ctrl.use_sub_V,
                               arith_neg_V,bus_alu1_operation_ctrl.use_neg_V,
                               BIT_VAL_0, BIT_VAL_0);

## Sheet 9 of 12
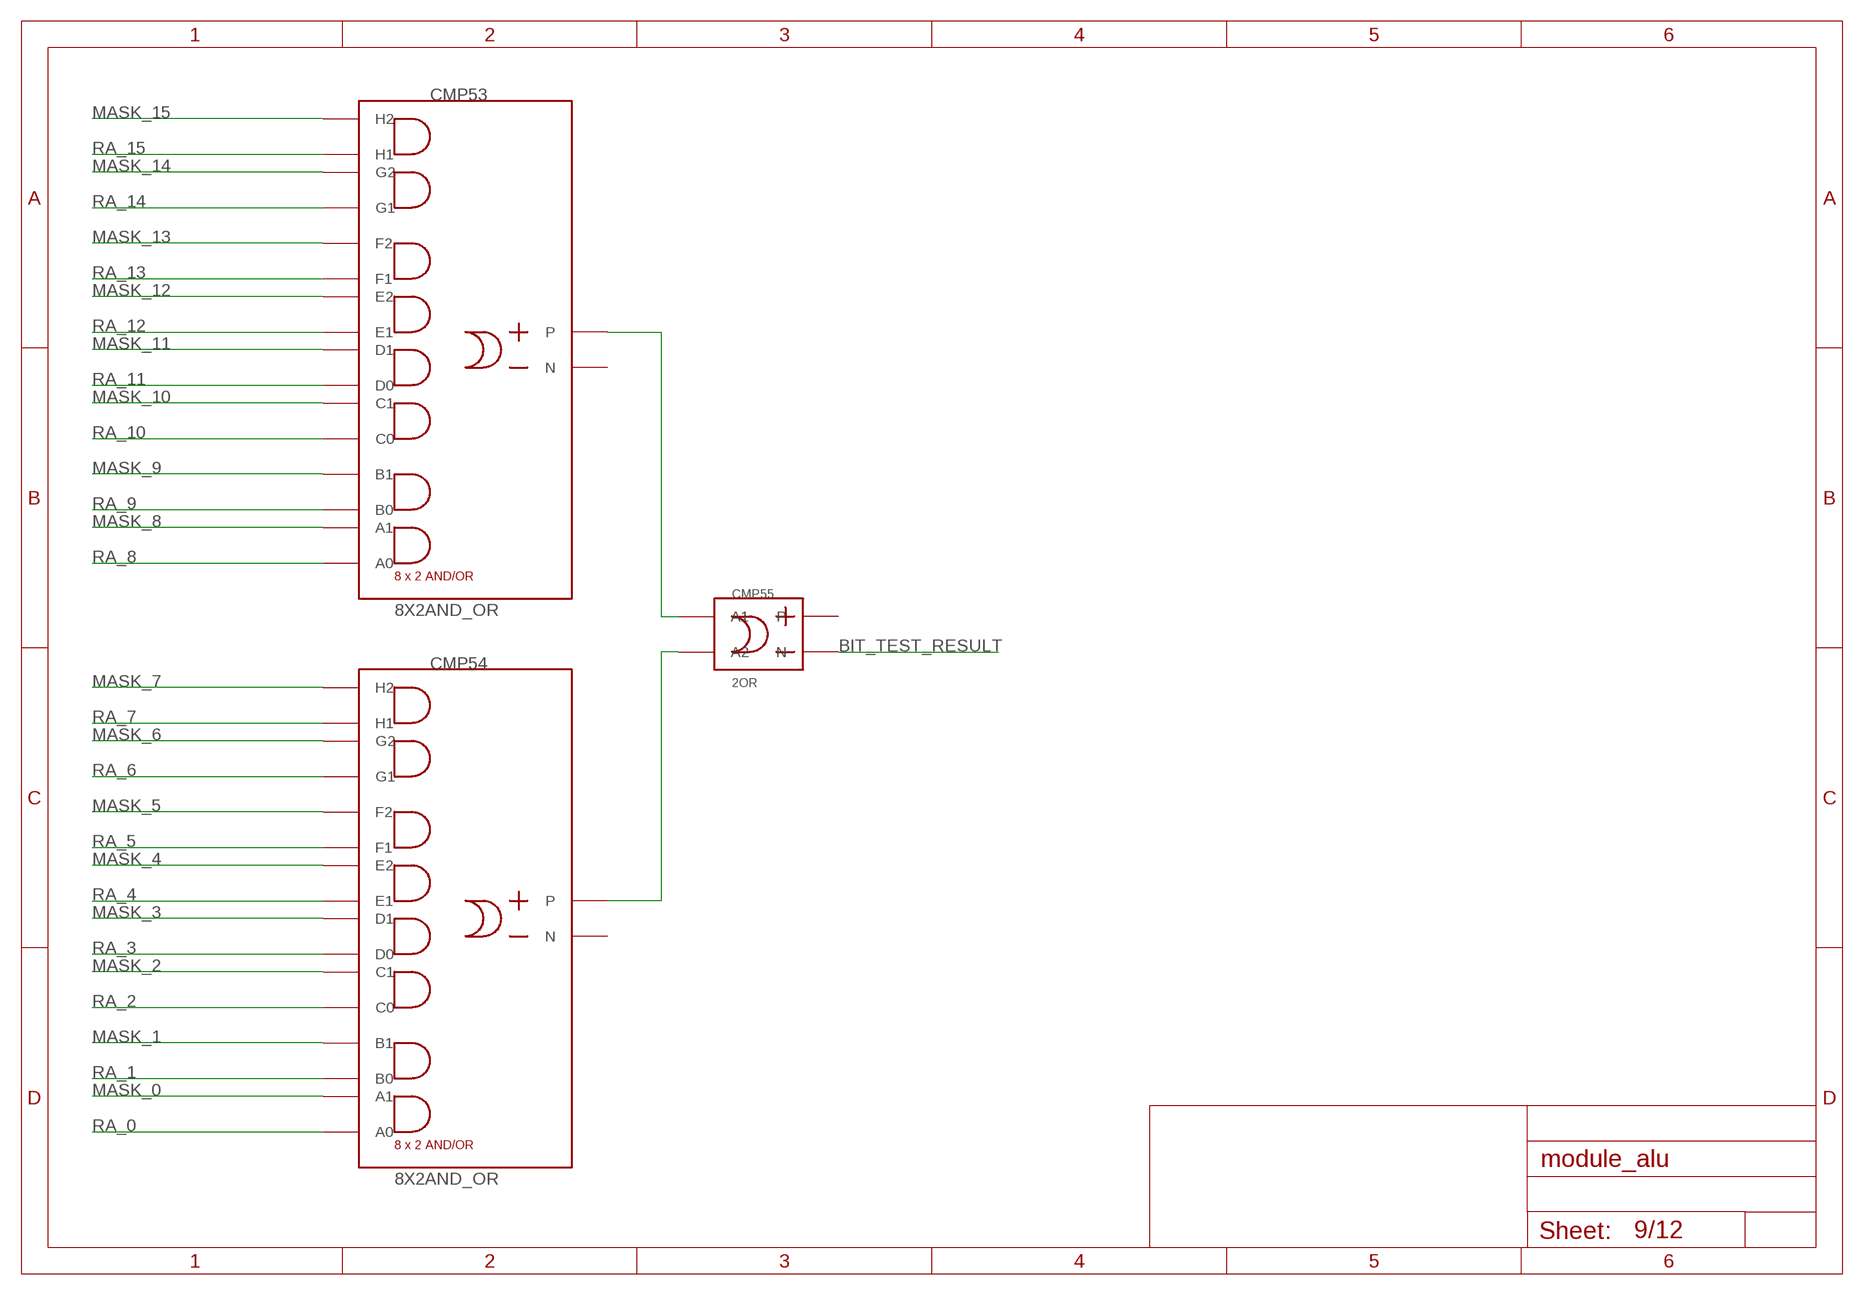
[diagram p8: schematic, sheet 9]

### Parts
CMP53  8X2AND_OR  [8X2AND_OR]
CMP54  8X2AND_OR  [8X2AND_OR]
CMP55  2OR  [2OR]

### Nets
BIT_TEST_RESULT: CMP55.OUT_M(N) ; also sheet 2
MASK_0: CMP54.P$2(A1) ; also sheet 7
MASK_1: CMP54.P$4(B1) ; also sheet 7
MASK_2: CMP54.P$6(C1) ; also sheet 7
MASK_3: CMP54.P$8(D1) ; also sheet 7
MASK_4: CMP54.P$10(E2) ; also sheet 7
MASK_5: CMP54.P$12(F2) ; also sheet 7
MASK_6: CMP54.P$14(G2) ; also sheet 7
MASK_7: CMP54.P$16(H2) ; also sheet 7
MASK_8: CMP53.P$2(A1) ; also sheet 7
MASK_9: CMP53.P$4(B1) ; also sheet 7
MASK_10: CMP53.P$6(C1) ; also sheet 7
MASK_11: CMP53.P$8(D1) ; also sheet 7
MASK_12: CMP53.P$10(E2) ; also sheet 7
MASK_13: CMP53.P$12(F2) ; also sheet 7
MASK_14: CMP53.P$14(G2) ; also sheet 7
MASK_15: CMP53.P$16(H2) ; also sheet 7
N$108: CMP53.OUT_P(P) CMP55.P$2(A1)
N$109: CMP54.OUT_P(P) CMP55.P$1(A2)
RA_0: CMP54.P$1(A0) ; also sheet 2
RA_1: CMP54.P$3(B0) ; also sheet 2
RA_2: CMP54.P$5(C0) ; also sheet 2
RA_3: CMP54.P$7(D0) ; also sheet 2
RA_4: CMP54.P$9(E1) ; also sheet 2
RA_5: CMP54.P$11(F1) ; also sheet 2
RA_6: CMP54.P$13(G1) ; also sheet 2
RA_7: CMP54.P$15(H1) ; also sheet 2
RA_8: CMP53.P$1(A0) ; also sheet 2
RA_9: CMP53.P$3(B0) ; also sheet 2
RA_10: CMP53.P$5(C0) ; also sheet 2
RA_11: CMP53.P$7(D0) ; also sheet 2
RA_12: CMP53.P$9(E1) ; also sheet 2
RA_13: CMP53.P$11(F1) ; also sheet 2
RA_14: CMP53.P$13(G1) ; also sheet 2,10
RA_15: CMP53.P$15(H1) ; also sheet 2
Unconnected: CMP53.OUT_M(N) CMP54.OUT_M(N) CMP55.OUT_P(P)

## Sheet 10 of 12
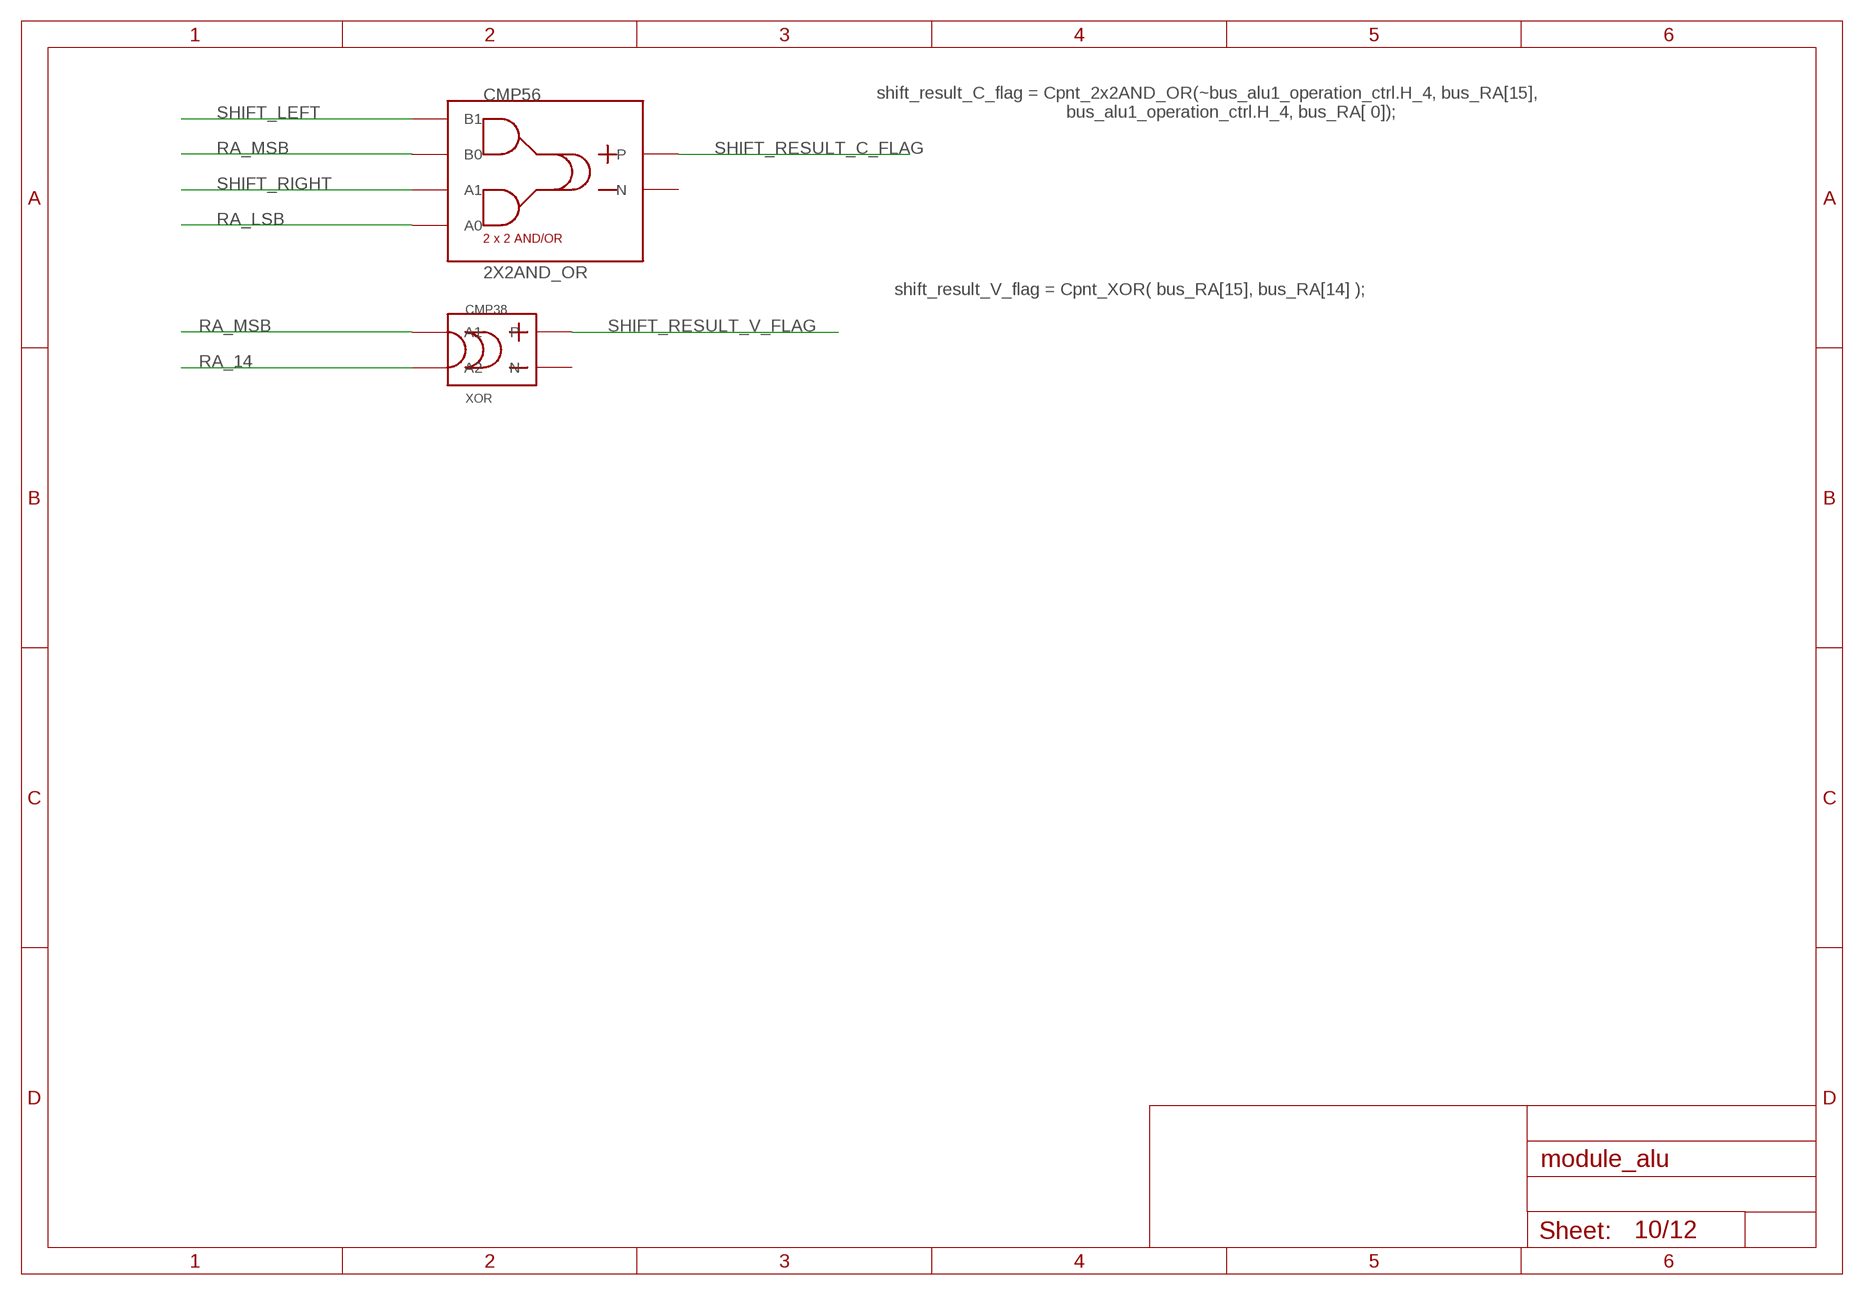
[diagram p9: schematic, sheet 10]

### Parts
CMP38  XOR  [XOR]
CMP56  2X2AND_OR  [2X2AND_OR]

### Nets
RA_14: CMP38.P$2(A2) ; also sheet 2,9
RA_LSB: CMP56.P$1(A0) ; also sheet 2,4
RA_MSB: CMP38.P$1(A1) CMP56.P$3(B0) ; also sheet 2,4
SHIFT_LEFT: CMP56.P$4(B1) ; also sheet 5
SHIFT_RESULT_C_FLAG: CMP56.OUT_P(P) ; also sheet 2
SHIFT_RESULT_V_FLAG: CMP38.OUT_P(P) ; also sheet 2
SHIFT_RIGHT: CMP56.P$2(A1) ; also sheet 5
Unconnected: CMP38.OUT_N(N) CMP56.OUT_M(N)

### Notes on the sheet
- shift_result_C_flag = Cpnt_2x2AND_OR(~bus_alu1_operation_ctrl.H_4, bus_RA[15],
                                            bus_alu1_operation_ctrl.H_4, bus_RA[ 0]);
- shift_result_V_flag = Cpnt_XOR( bus_RA[15], bus_RA[14] );

## Sheet 11 of 12
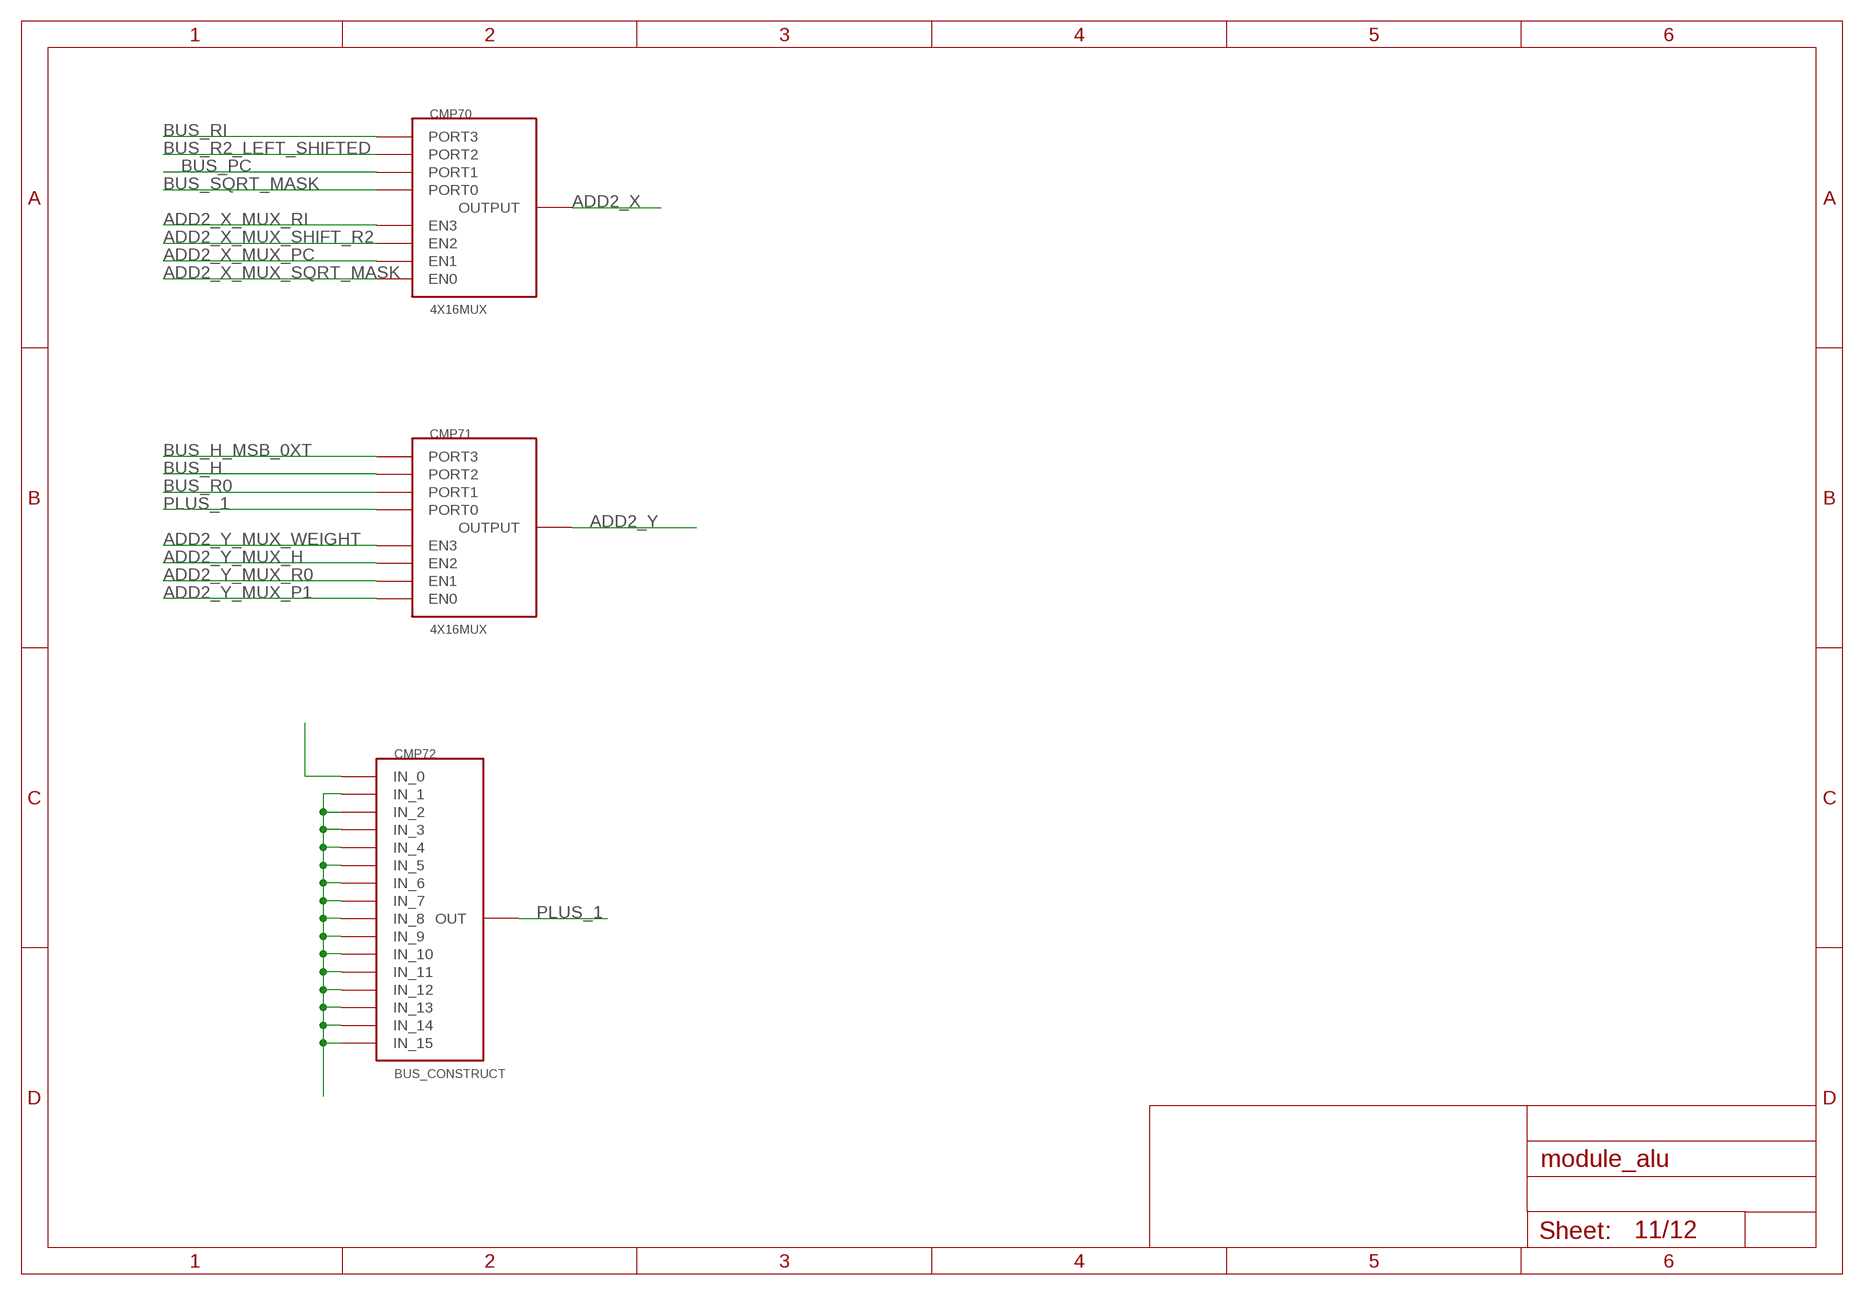
[diagram p10: schematic, sheet 11]

### Parts
CMP70  4X16MUX  [4X16MUX]
CMP71  4X16MUX  [4X16MUX]
CMP72  BUS_CONSTRUCT  [BUS_SPLIT]

### Nets
ADD2_X: CMP70.PORTOUT(OUTPUT) ; also sheet 12
ADD2_X_MUX_PC: CMP70.EN1 ; also sheet 1
ADD2_X_MUX_RI: CMP70.EN3 ; also sheet 1
ADD2_X_MUX_SHIFT_R2: CMP70.EN2 ; also sheet 1
ADD2_X_MUX_SQRT_MASK: CMP70.EN0 ; also sheet 1
ADD2_Y: CMP71.PORTOUT(OUTPUT) ; also sheet 12
ADD2_Y_MUX_H: CMP71.EN2 ; also sheet 1
ADD2_Y_MUX_P1: CMP71.EN0 ; also sheet 1
ADD2_Y_MUX_R0: CMP71.EN1 ; also sheet 1
ADD2_Y_MUX_WEIGHT: CMP71.EN3 ; also sheet 1
BUS_H: CMP71.PORT2 ; also sheet 3
BUS_H_MSB_0XT: CMP71.PORT3 ; also sheet 3
BUS_PC: CMP70.PORT1 ; also sheet 3
BUS_R0: CMP71.PORT1 ; also sheet 3
BUS_R2_LEFT_SHIFTED: CMP70.PORT2 ; also sheet 3
BUS_RI: CMP70.PORT3 ; also sheet 3
BUS_SQRT_MASK: CMP70.PORT0 ; also sheet 3
N$2: CMP72.P$1(IN_0)
N$3: CMP72.P$2(IN_1) CMP72.P$3(IN_2) CMP72.P$4(IN_3) CMP72.P$5(IN_4) CMP72.P$6(IN_5) CMP72.P$7(IN_6) CMP72.P$8(IN_7) CMP72.P$9(IN_8) CMP72.P$10(IN_9) CMP72.P$11(IN_10) CMP72.P$12(IN_11) CMP72.P$13(IN_12) CMP72.P$14(IN_13) CMP72.P$15(IN_14) CMP72.P$16(IN_15)
PLUS_1: CMP71.PORT0 CMP72.INPUT(OUT)

## Sheet 12 of 12
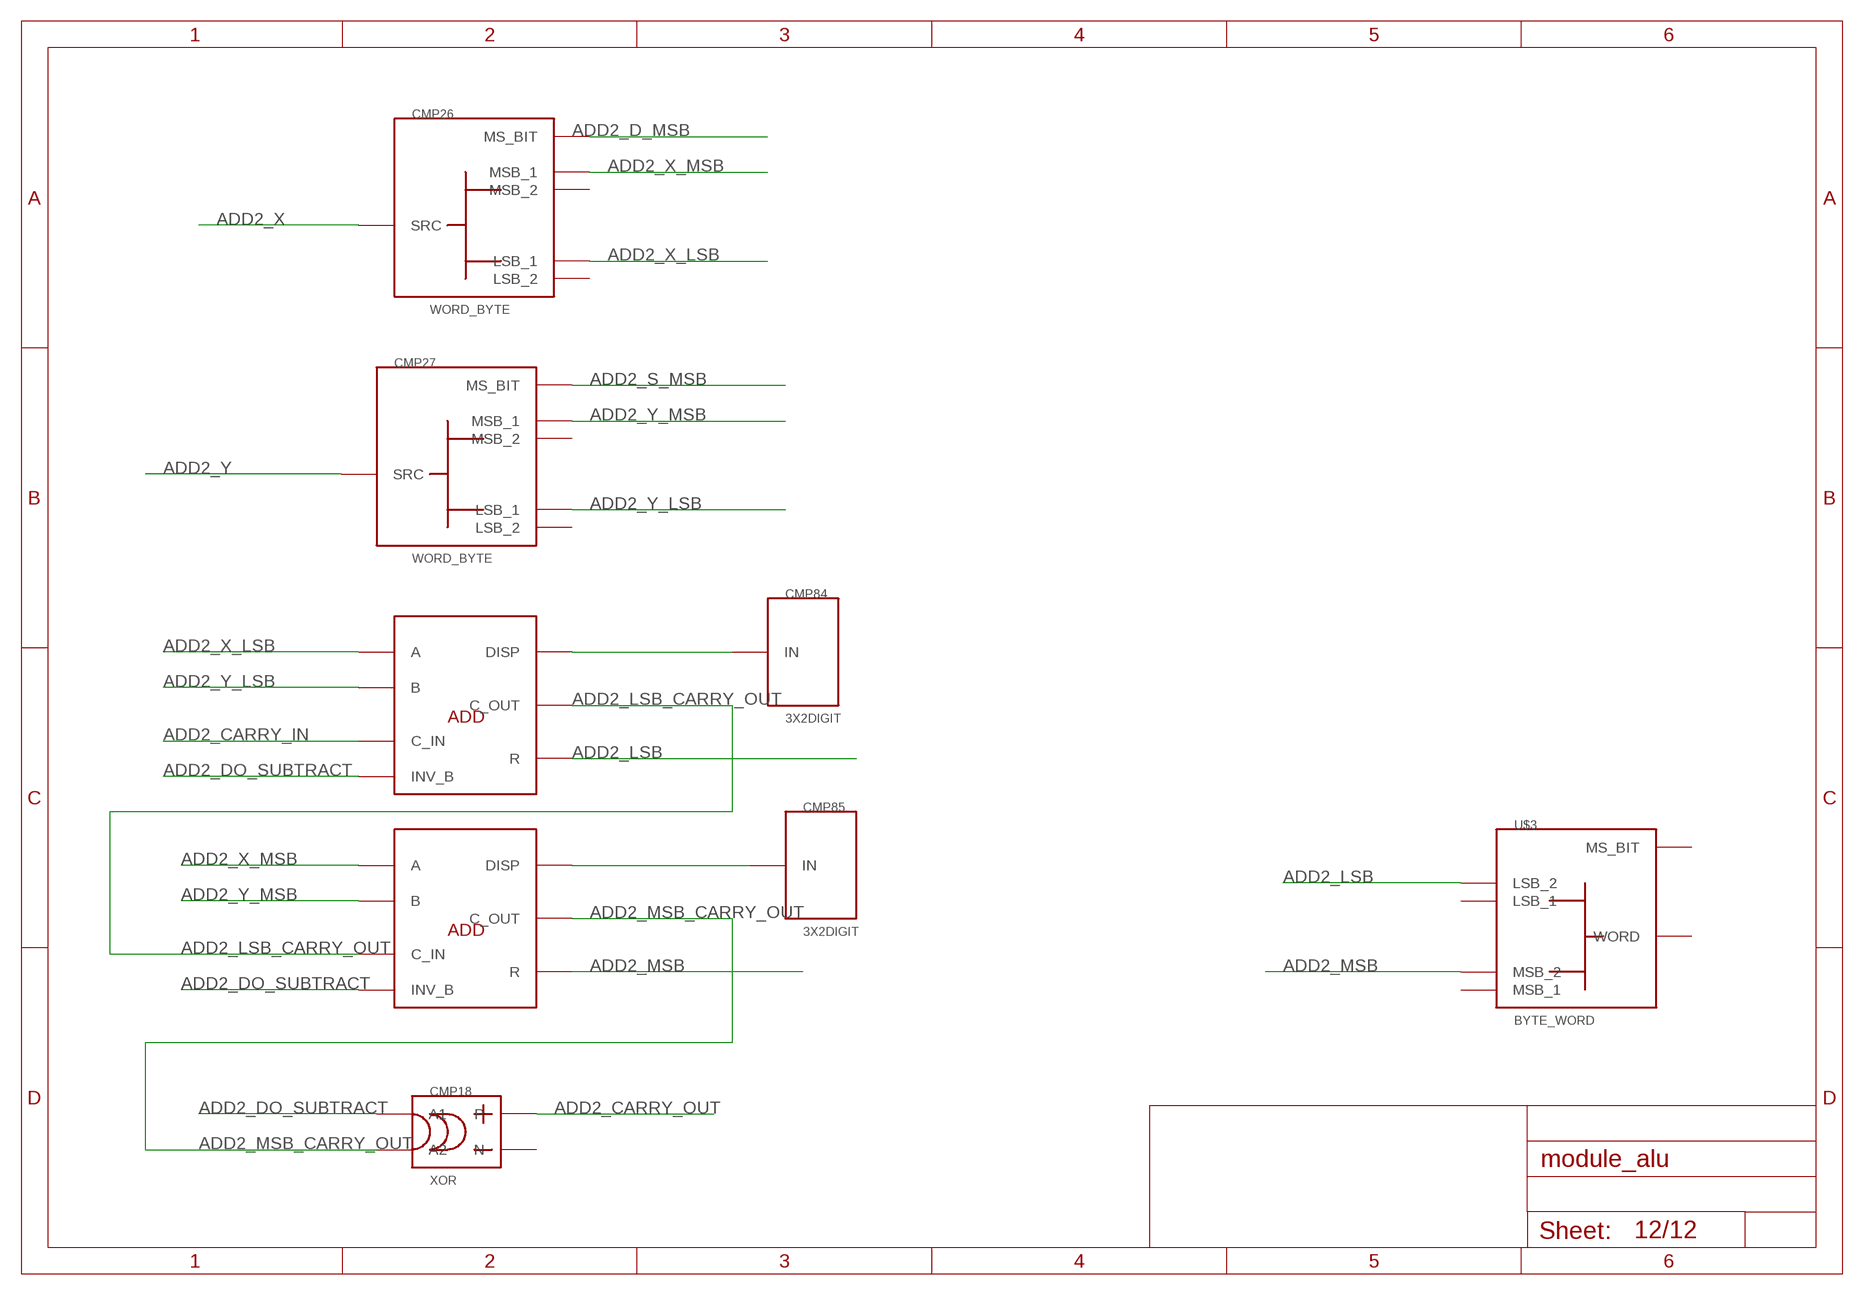
[diagram p11: schematic, sheet 12]

### Parts
CMP18  XOR  [XOR]
CMP26  WORD_BYTE  [WORD_BYTE]
CMP27  WORD_BYTE  [WORD_BYTE]
CMP82  8BIT_ADD_SUB  [8BIT_ADD_SUB]
CMP83  8BIT_ADD_SUB  [8BIT_ADD_SUB]
CMP84  3X2DIGIT  [3X2DIGIT]
CMP85  3X2DIGIT  [3X2DIGIT]
U$3  BYTE_WORD  [WORD_BYTE]

### Nets
ADD2_CARRY_IN: CMP82.C_IN ; also sheet 1
ADD2_CARRY_OUT: CMP18.OUT_P(P) ; also sheet 2
ADD2_D_MSB: CMP26.MS_BIT
ADD2_DO_SUBTRACT: CMP18.P$1(A1) CMP82.INV_B CMP83.INV_B ; also sheet 1
ADD2_LSB: CMP82.R U$3.LSB_2
ADD2_LSB_CARRY_OUT: CMP82.C_OUT CMP83.C_IN
ADD2_MSB: CMP83.R U$3.MSB_2
ADD2_MSB_CARRY_OUT: CMP18.P$2(A2) CMP83.C_OUT
ADD2_S_MSB: CMP27.MS_BIT
ADD2_X: CMP26.SRC ; also sheet 11
ADD2_X_LSB: CMP26.LSB_1 CMP82.A
ADD2_X_MSB: CMP26.MSB_1 CMP83.A
ADD2_Y: CMP27.SRC ; also sheet 11
ADD2_Y_LSB: CMP27.LSB_1 CMP82.B
ADD2_Y_MSB: CMP27.MSB_1 CMP83.B
N$143: CMP82.DISP CMP84.P$1(IN)
N$144: CMP83.DISP CMP85.P$1(IN)
Unconnected: CMP18.OUT_N(N) CMP26.LSB_2 CMP26.MSB_2 CMP27.LSB_2 CMP27.MSB_2 U$3.LSB_1 U$3.MS_BIT U$3.MSB_1 U$3.SRC(WORD)

## Library data of the parts
CMP1 CMP2 CMP7 CMP69 = modules:BUS_SPLIT_DISPLAY
CMP3 = modules:BUS_4TEE
CMP4-CMP6 CMP12 CMP16 CMP17 CMP24 CMP61 CMP66 CMP68 = modules:BUS_2_BUS
CMP8 = modules:LEFT_SHIFT_ZERO
CMP9 CMP10 CMP60 CMP70 CMP71 = modules:4X16MUX
CMP11 = modules:DECODER16
CMP13 CMP14 CMP19 CMP51 = modules:BUS_CONSTRUCT_DISPLAY
CMP15 = modules:RIGHT_SHIFT
CMP18 CMP38 CMP45 = modules:XOR
CMP25 CMP28 CMP72 CMP93 = modules:BUS_CONSTRUCT
CMP26 CMP27 CMP35 CMP36 = modules:WORD_BYTE
CMP30 = modules:BUS_TEE
CMP31 CMP32 CMP82 CMP83 = modules:8BIT_ADD_SUB
CMP33 CMP34 CMP41 CMP42 CMP84 CMP85 = modules:3X2DIGIT
CMP39 = modules:4BUF
CMP46 CMP47 = modules:8BIT_LOGIC
CMP48 CMP49 = modules:2X3AND_OR
CMP50 = modules:2AND
CMP52 = modules:4X2AND_OR
CMP53 CMP54 = modules:8X2AND_OR
CMP55 = modules:2OR
CMP56 = modules:2X2AND_OR
U$1 U$3 U$8 = modules:BYTE_WORD